# EasyEDA Pro project ProPrj_Chlorophyll two boards_2024-09-17.epro

# Schematic Spectroscope and Oxygen Sensor

## Sheets
1 Main Board: Create Date: 2024-07-14; Page Name: Main Board; Project Name: Chlorophyll two boards; Schematic Name: Spectroscope; Update Date: 2024-07-24; Company: VUB; Drawn: Tim Jäger; Page Size: A4; Part Number: Spectro-Oxy; Version: V3.2
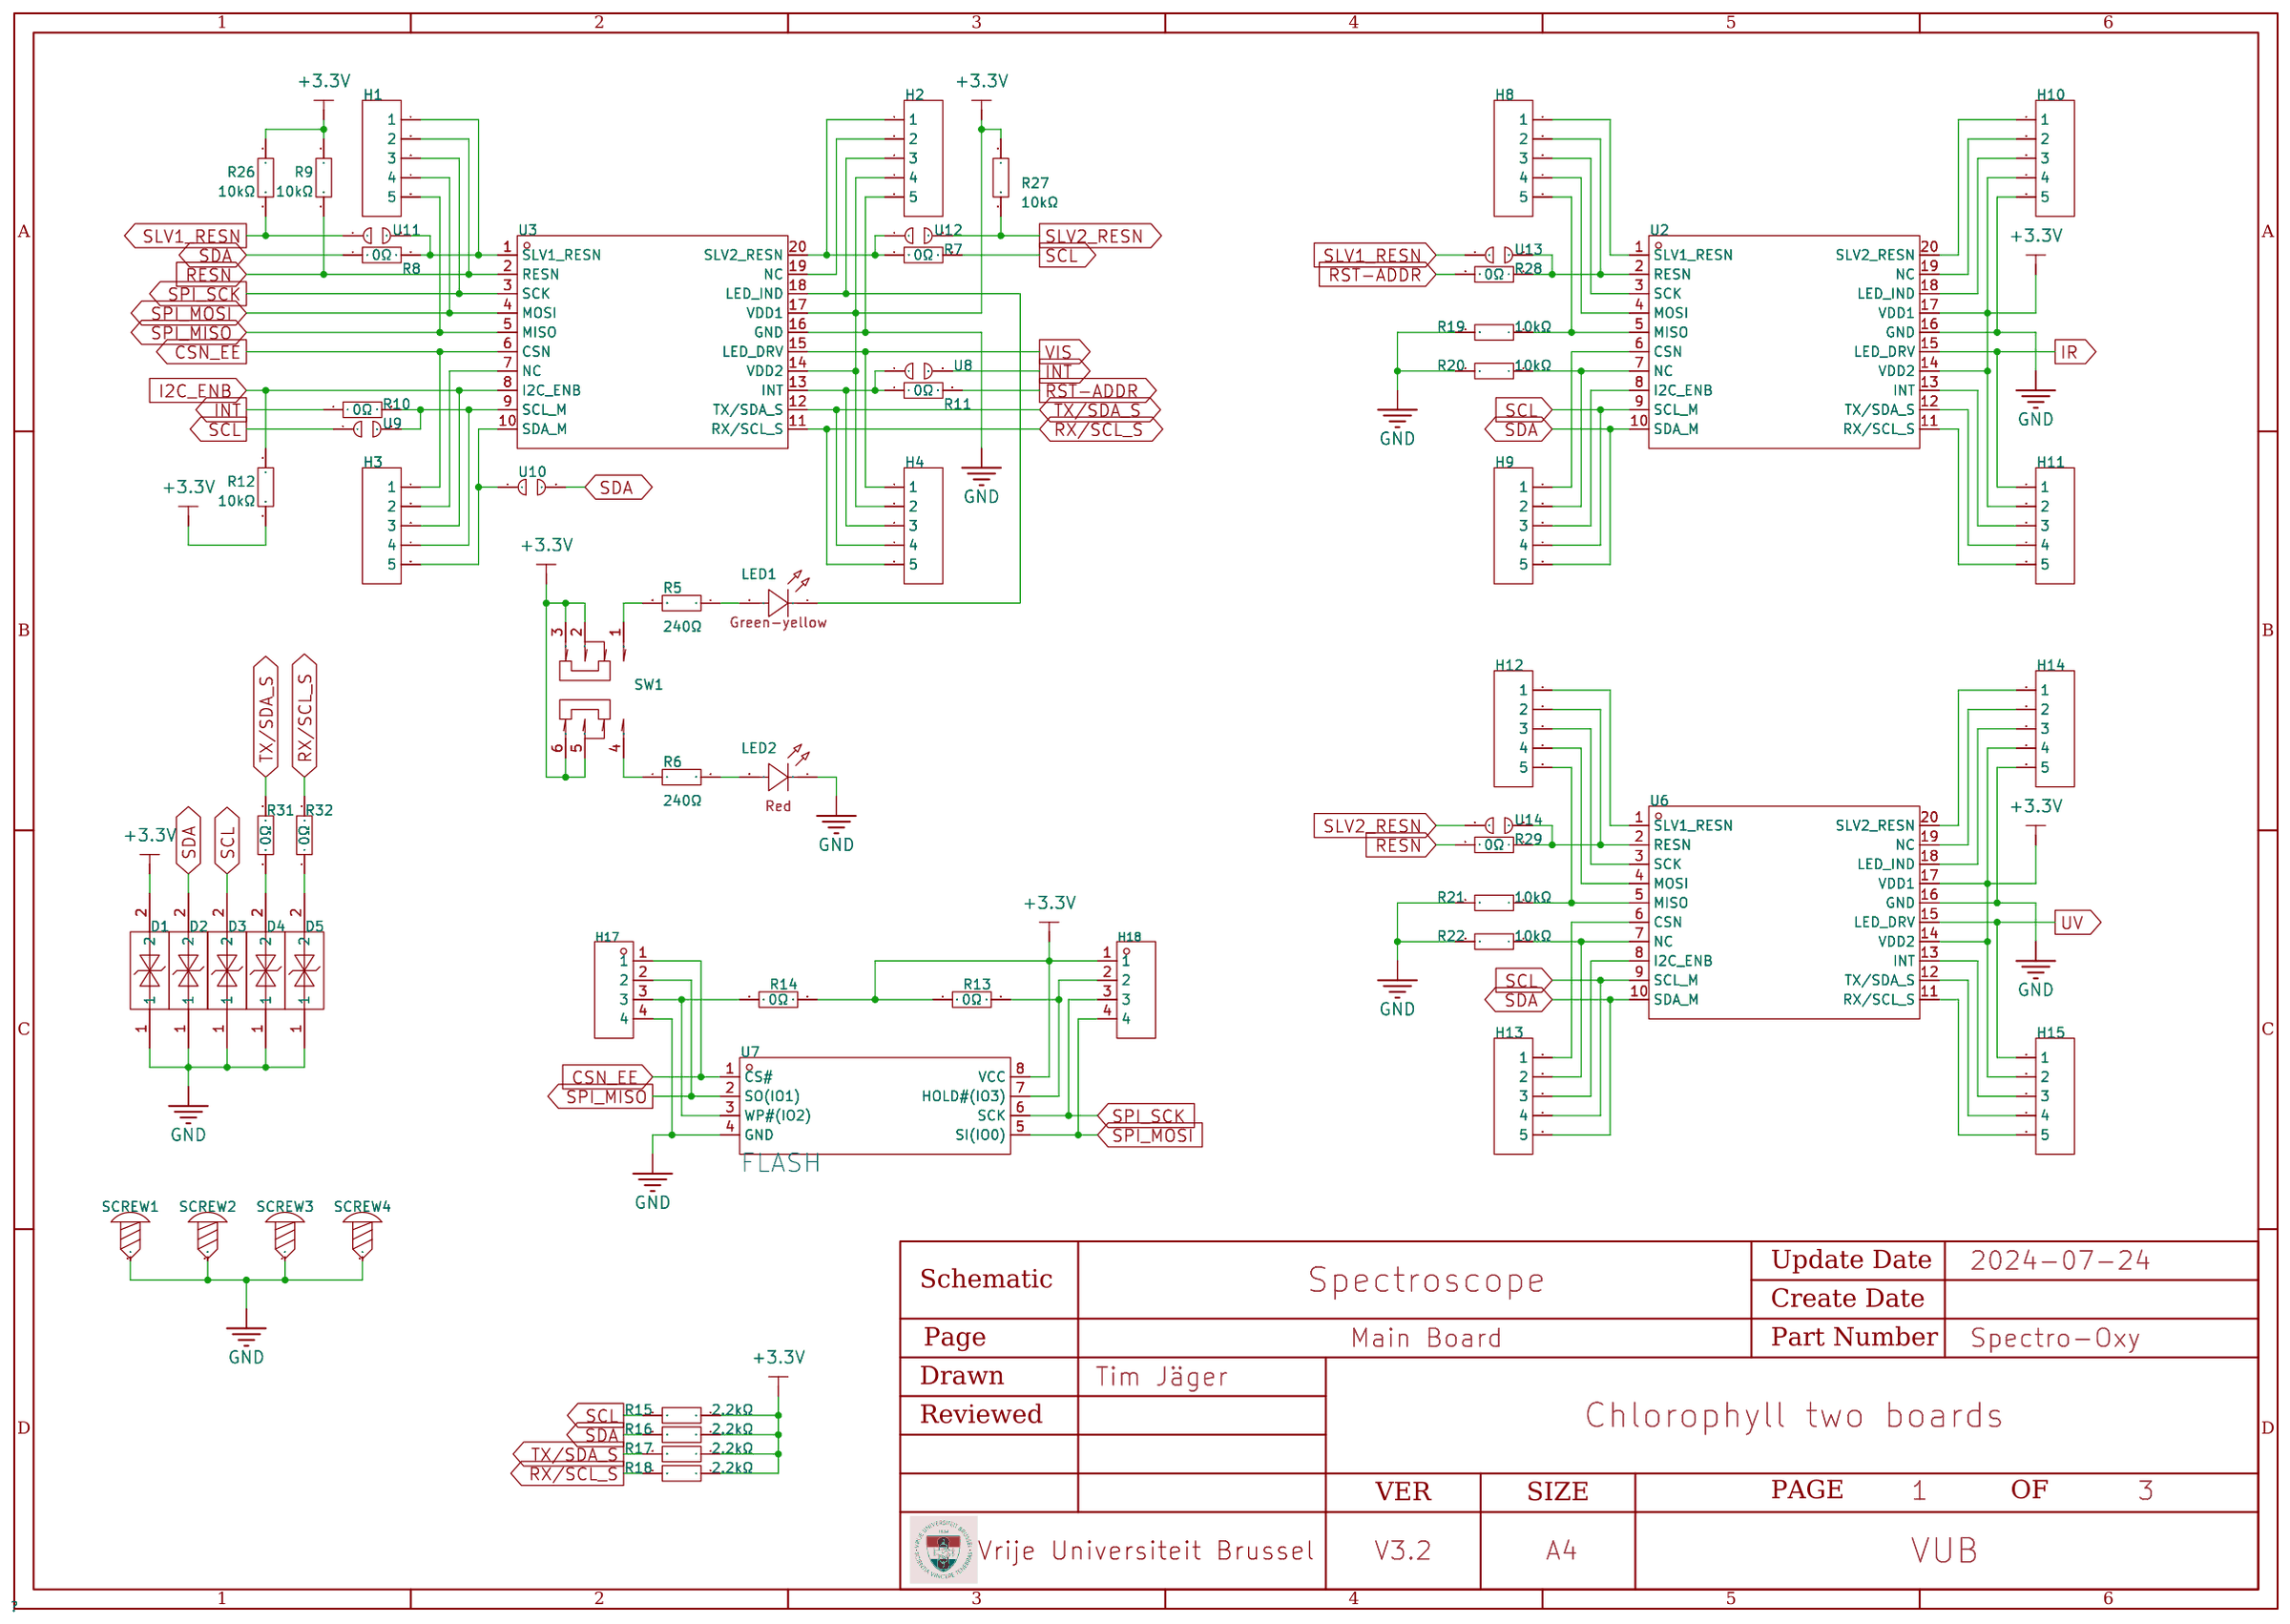
[diagram p0: Main Board]
2 Lighting Board: Page Name: Lighting Board.Schematic1; Schematic Name: Schematic1; Update Date: 2024-07-23
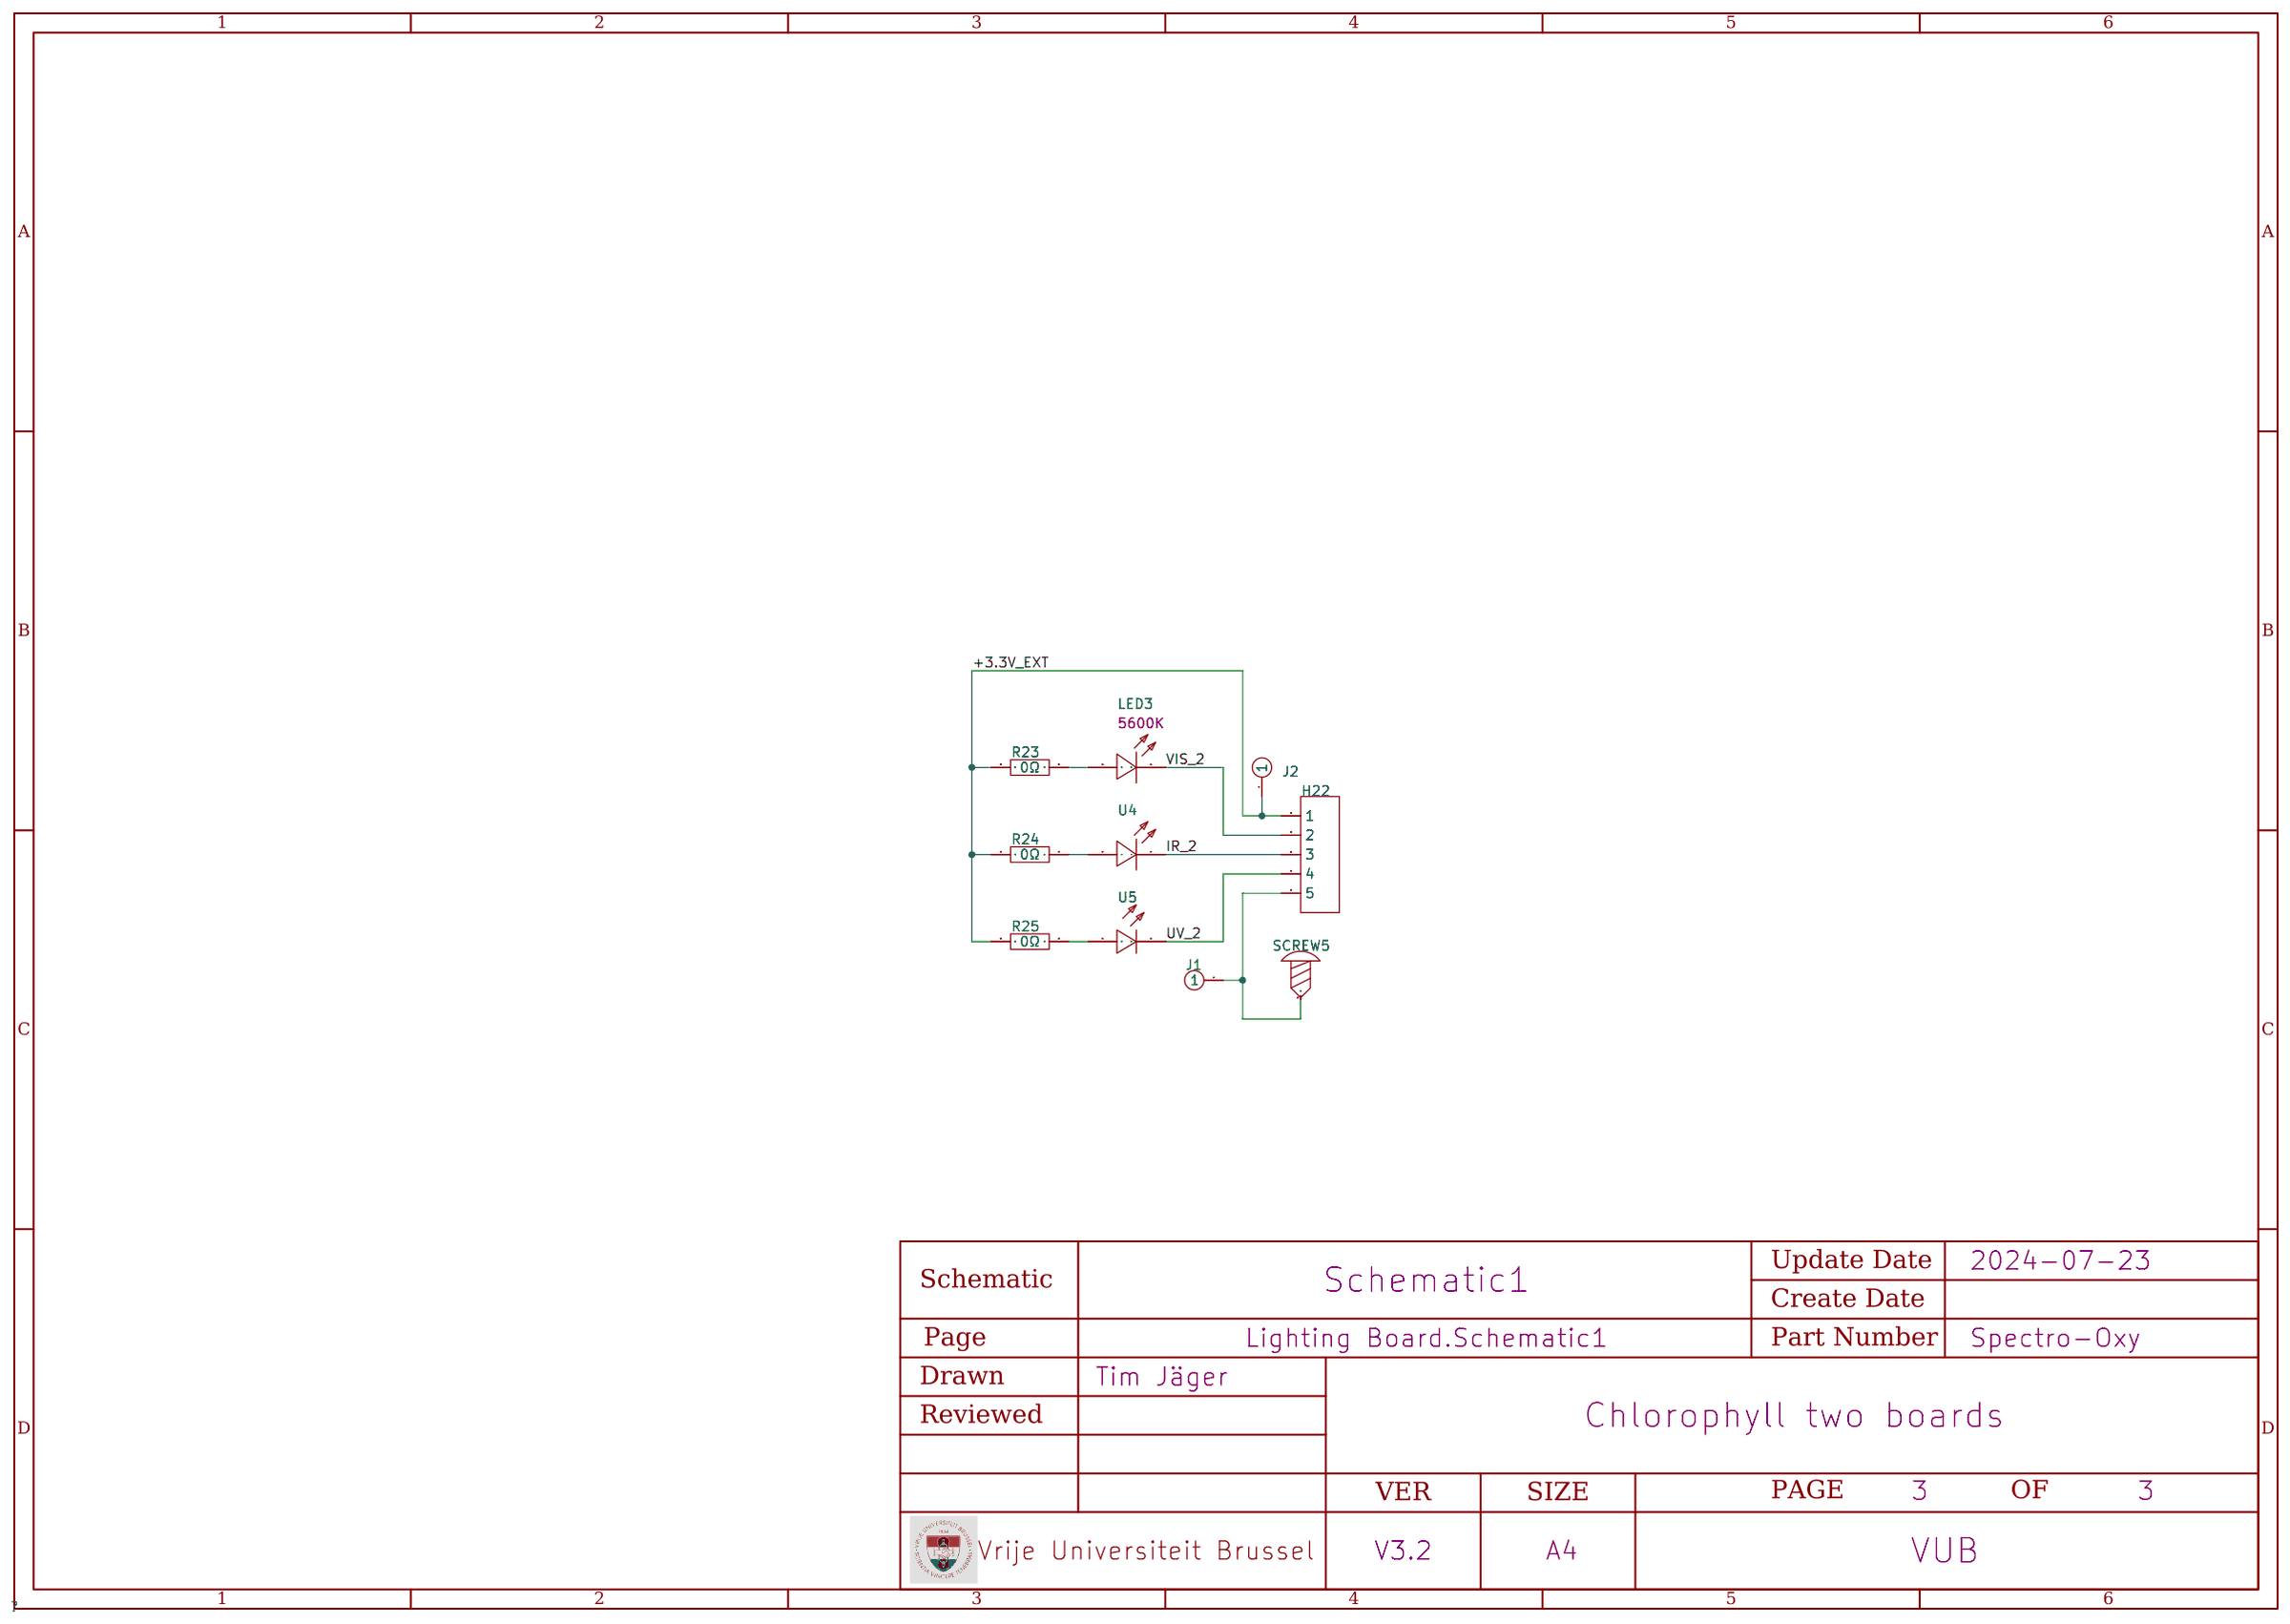
[diagram p1: Lighting Board]
3 Main Board Connectors: Create Date: 2024-07-23; Page Name: Main Board Connectors
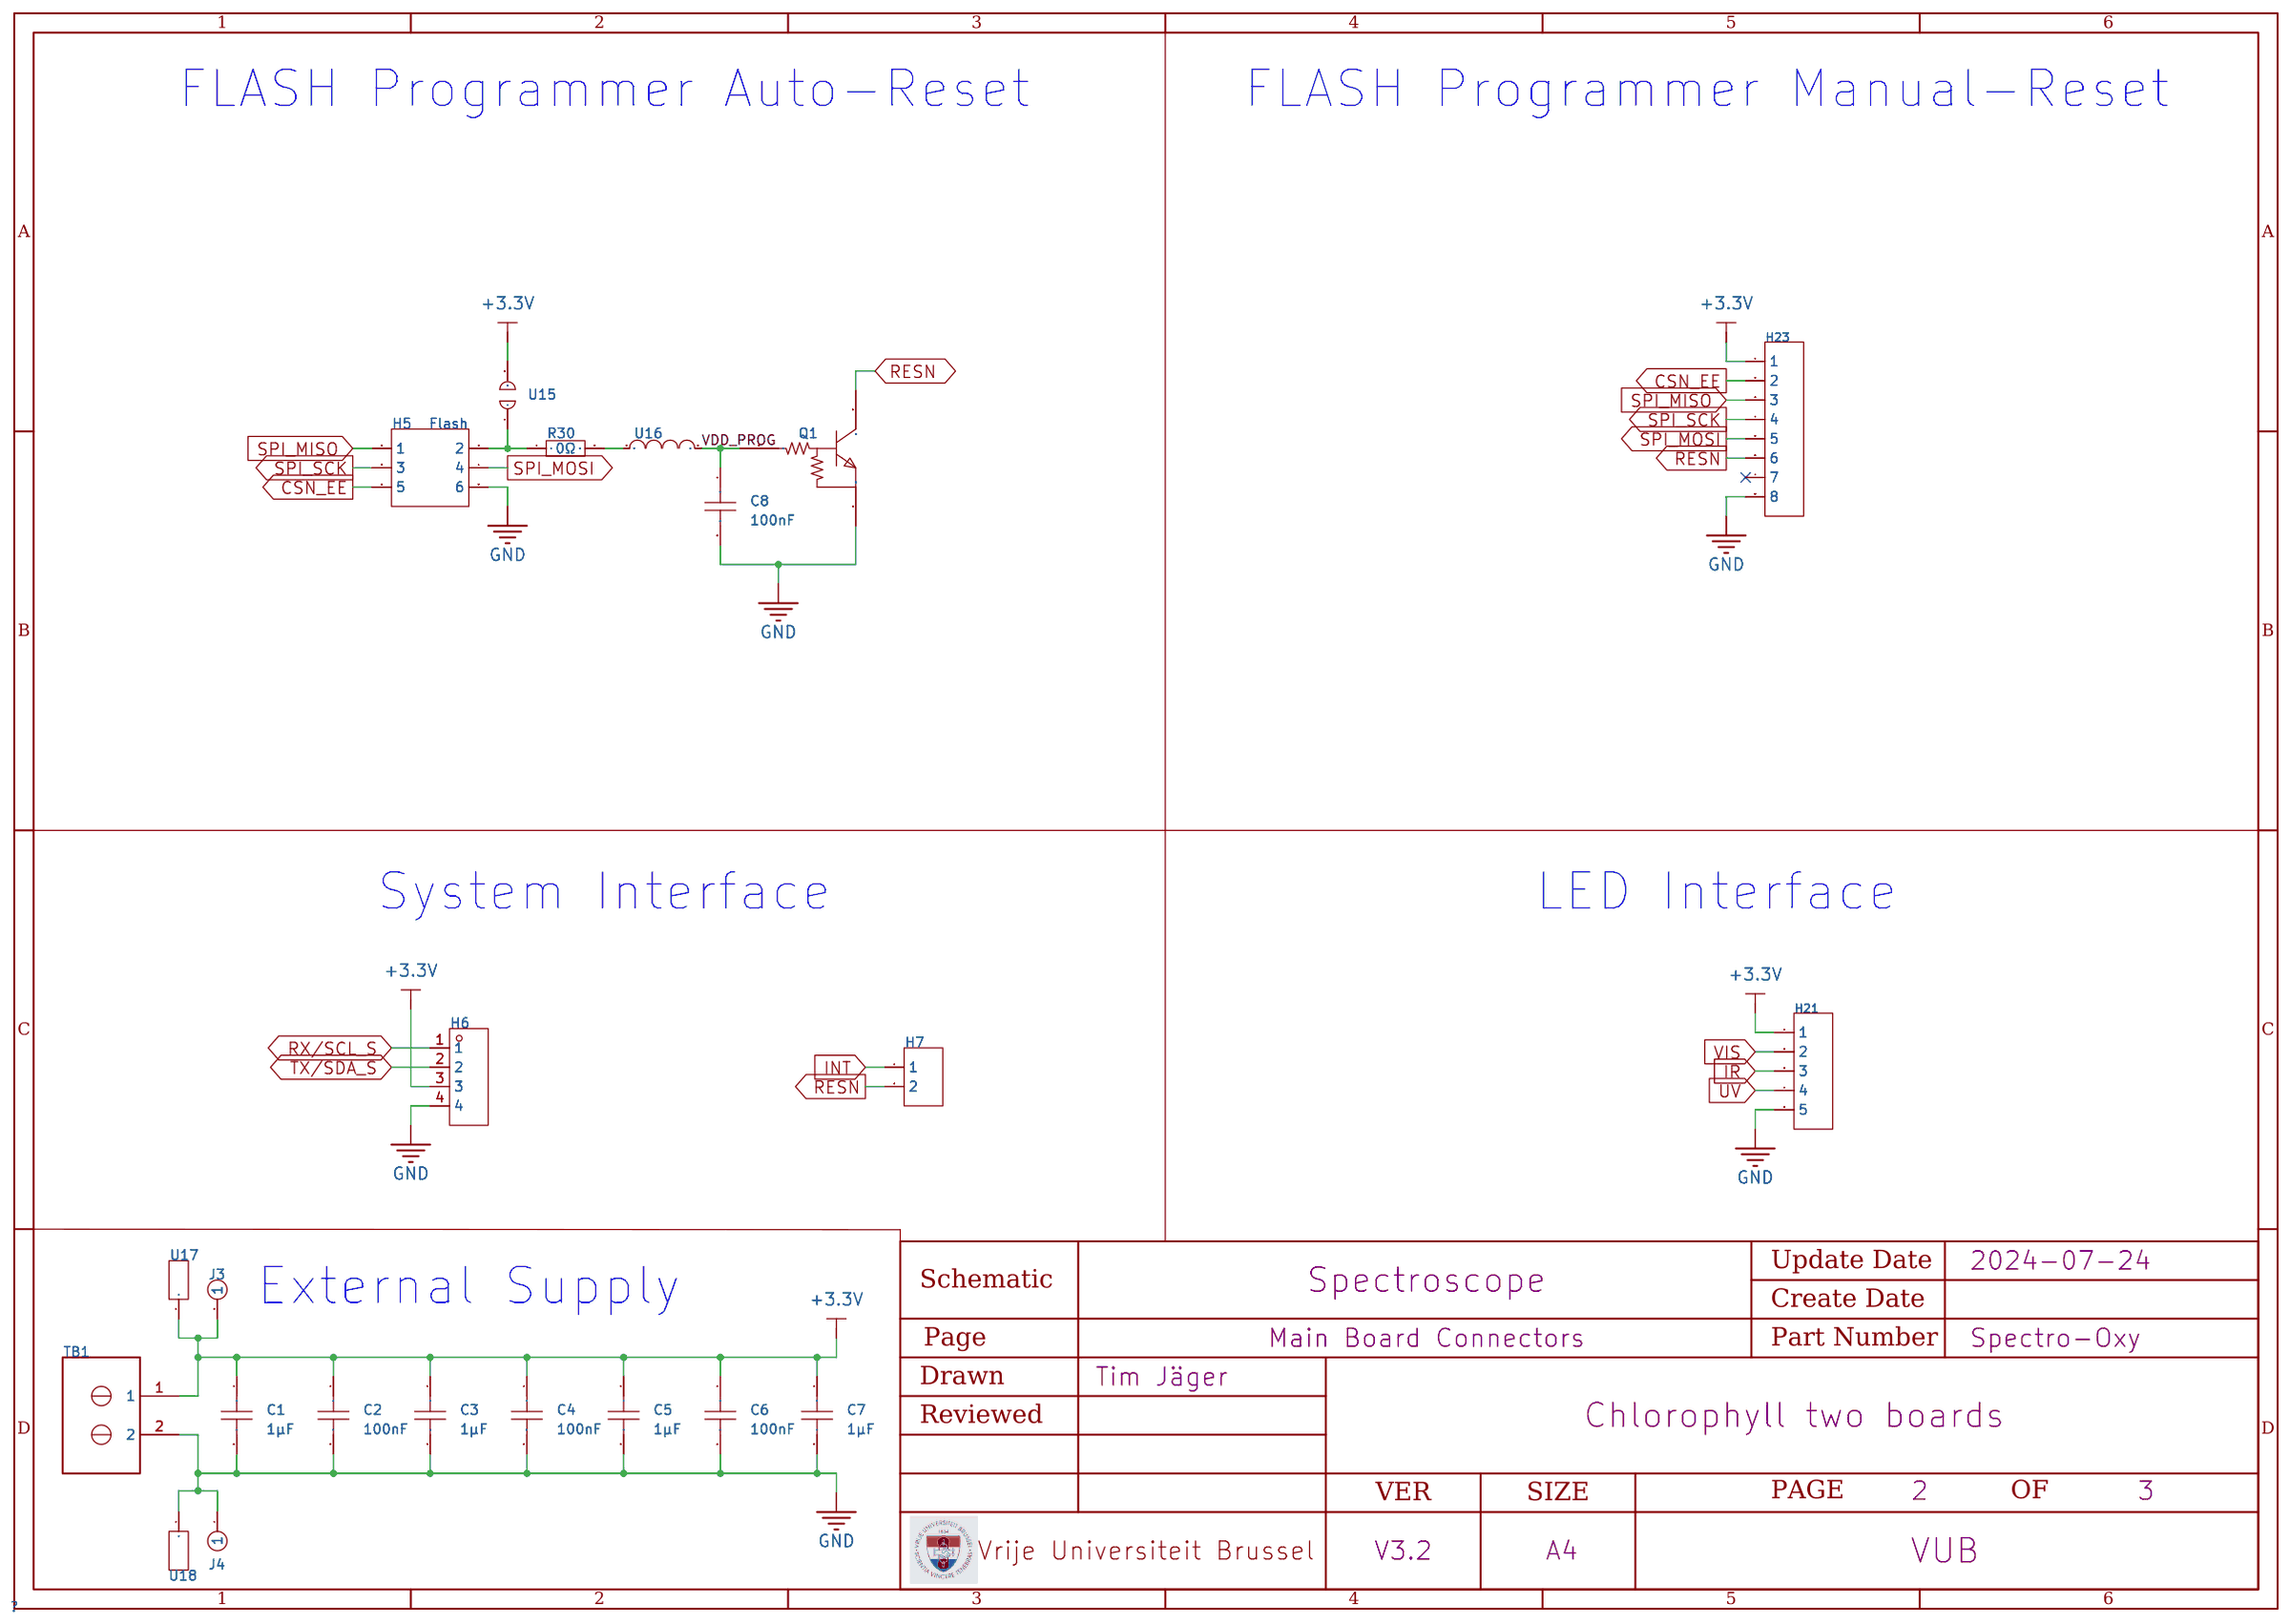
[diagram p2: Main Board Connectors]
4 Level Shifter: Create Date: 2024-07-23; Page Name: Level Shifter
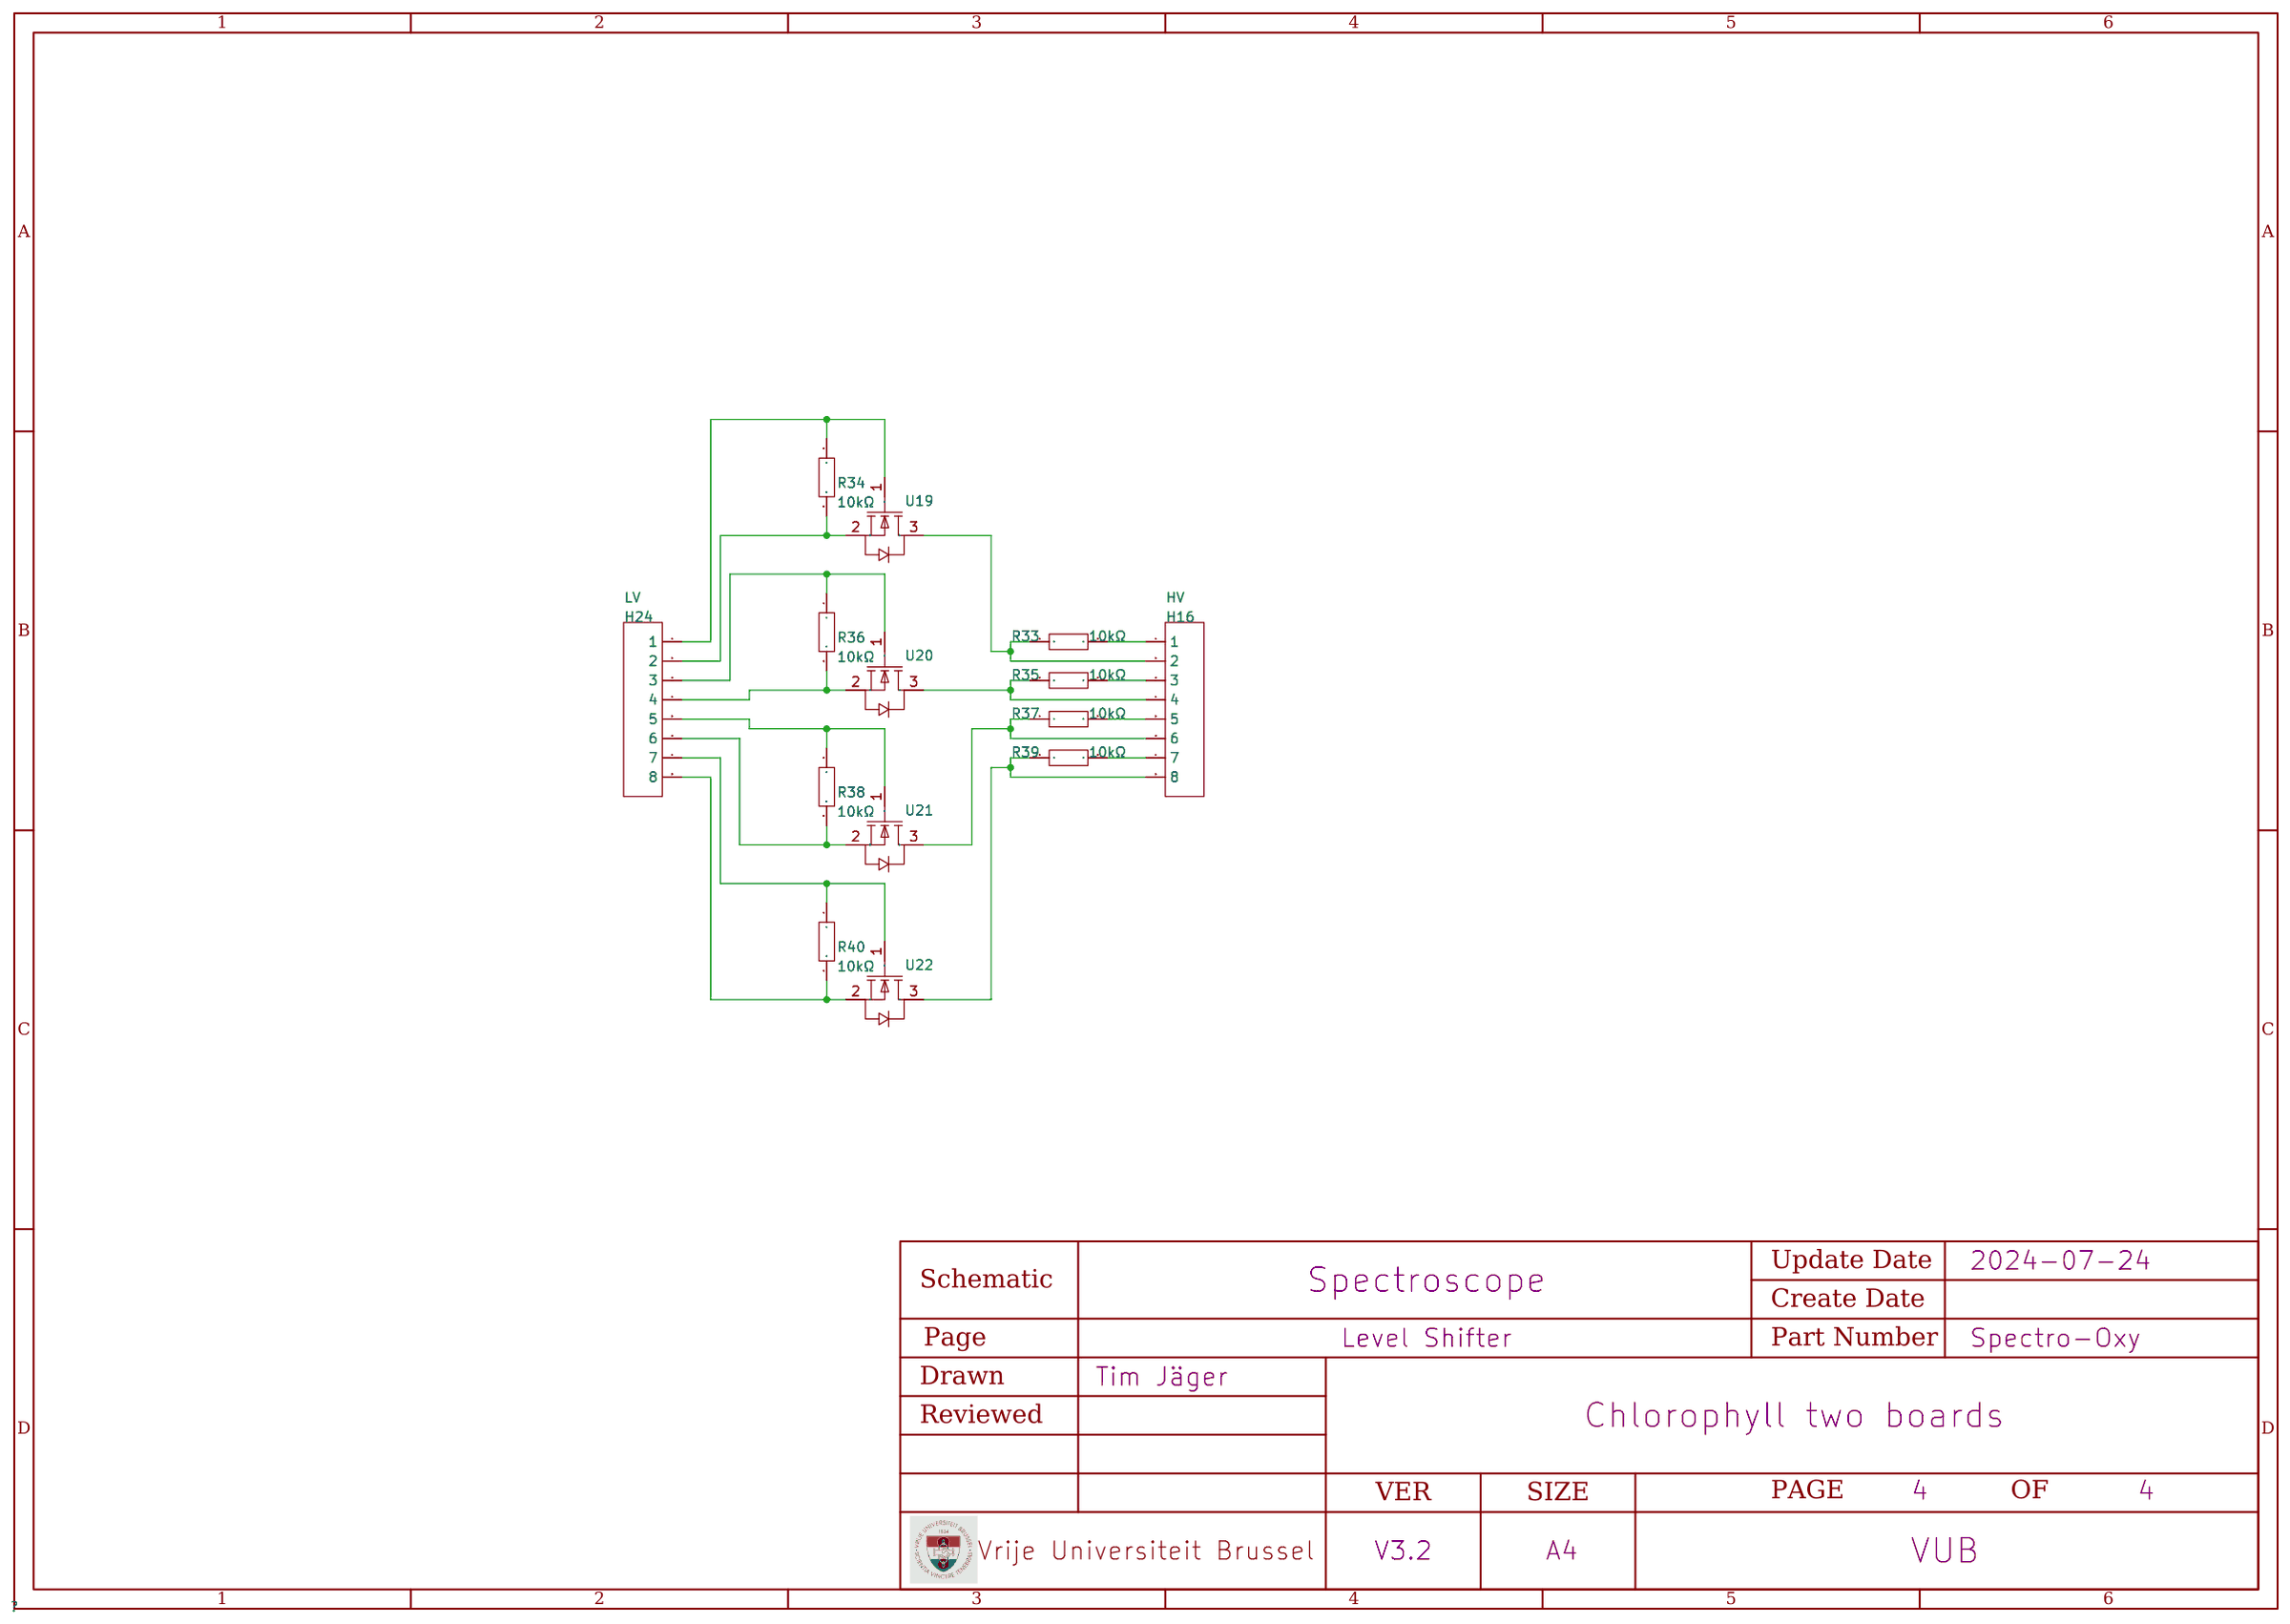
[diagram p3: Level Shifter]
5 Oxygen Sensor: Create Date: 2024-07-23; Page Name: Oxygen Sensor.Spectroscope and Oxygen Sensor; Schematic Name: Spectroscope and Oxygen Sensor
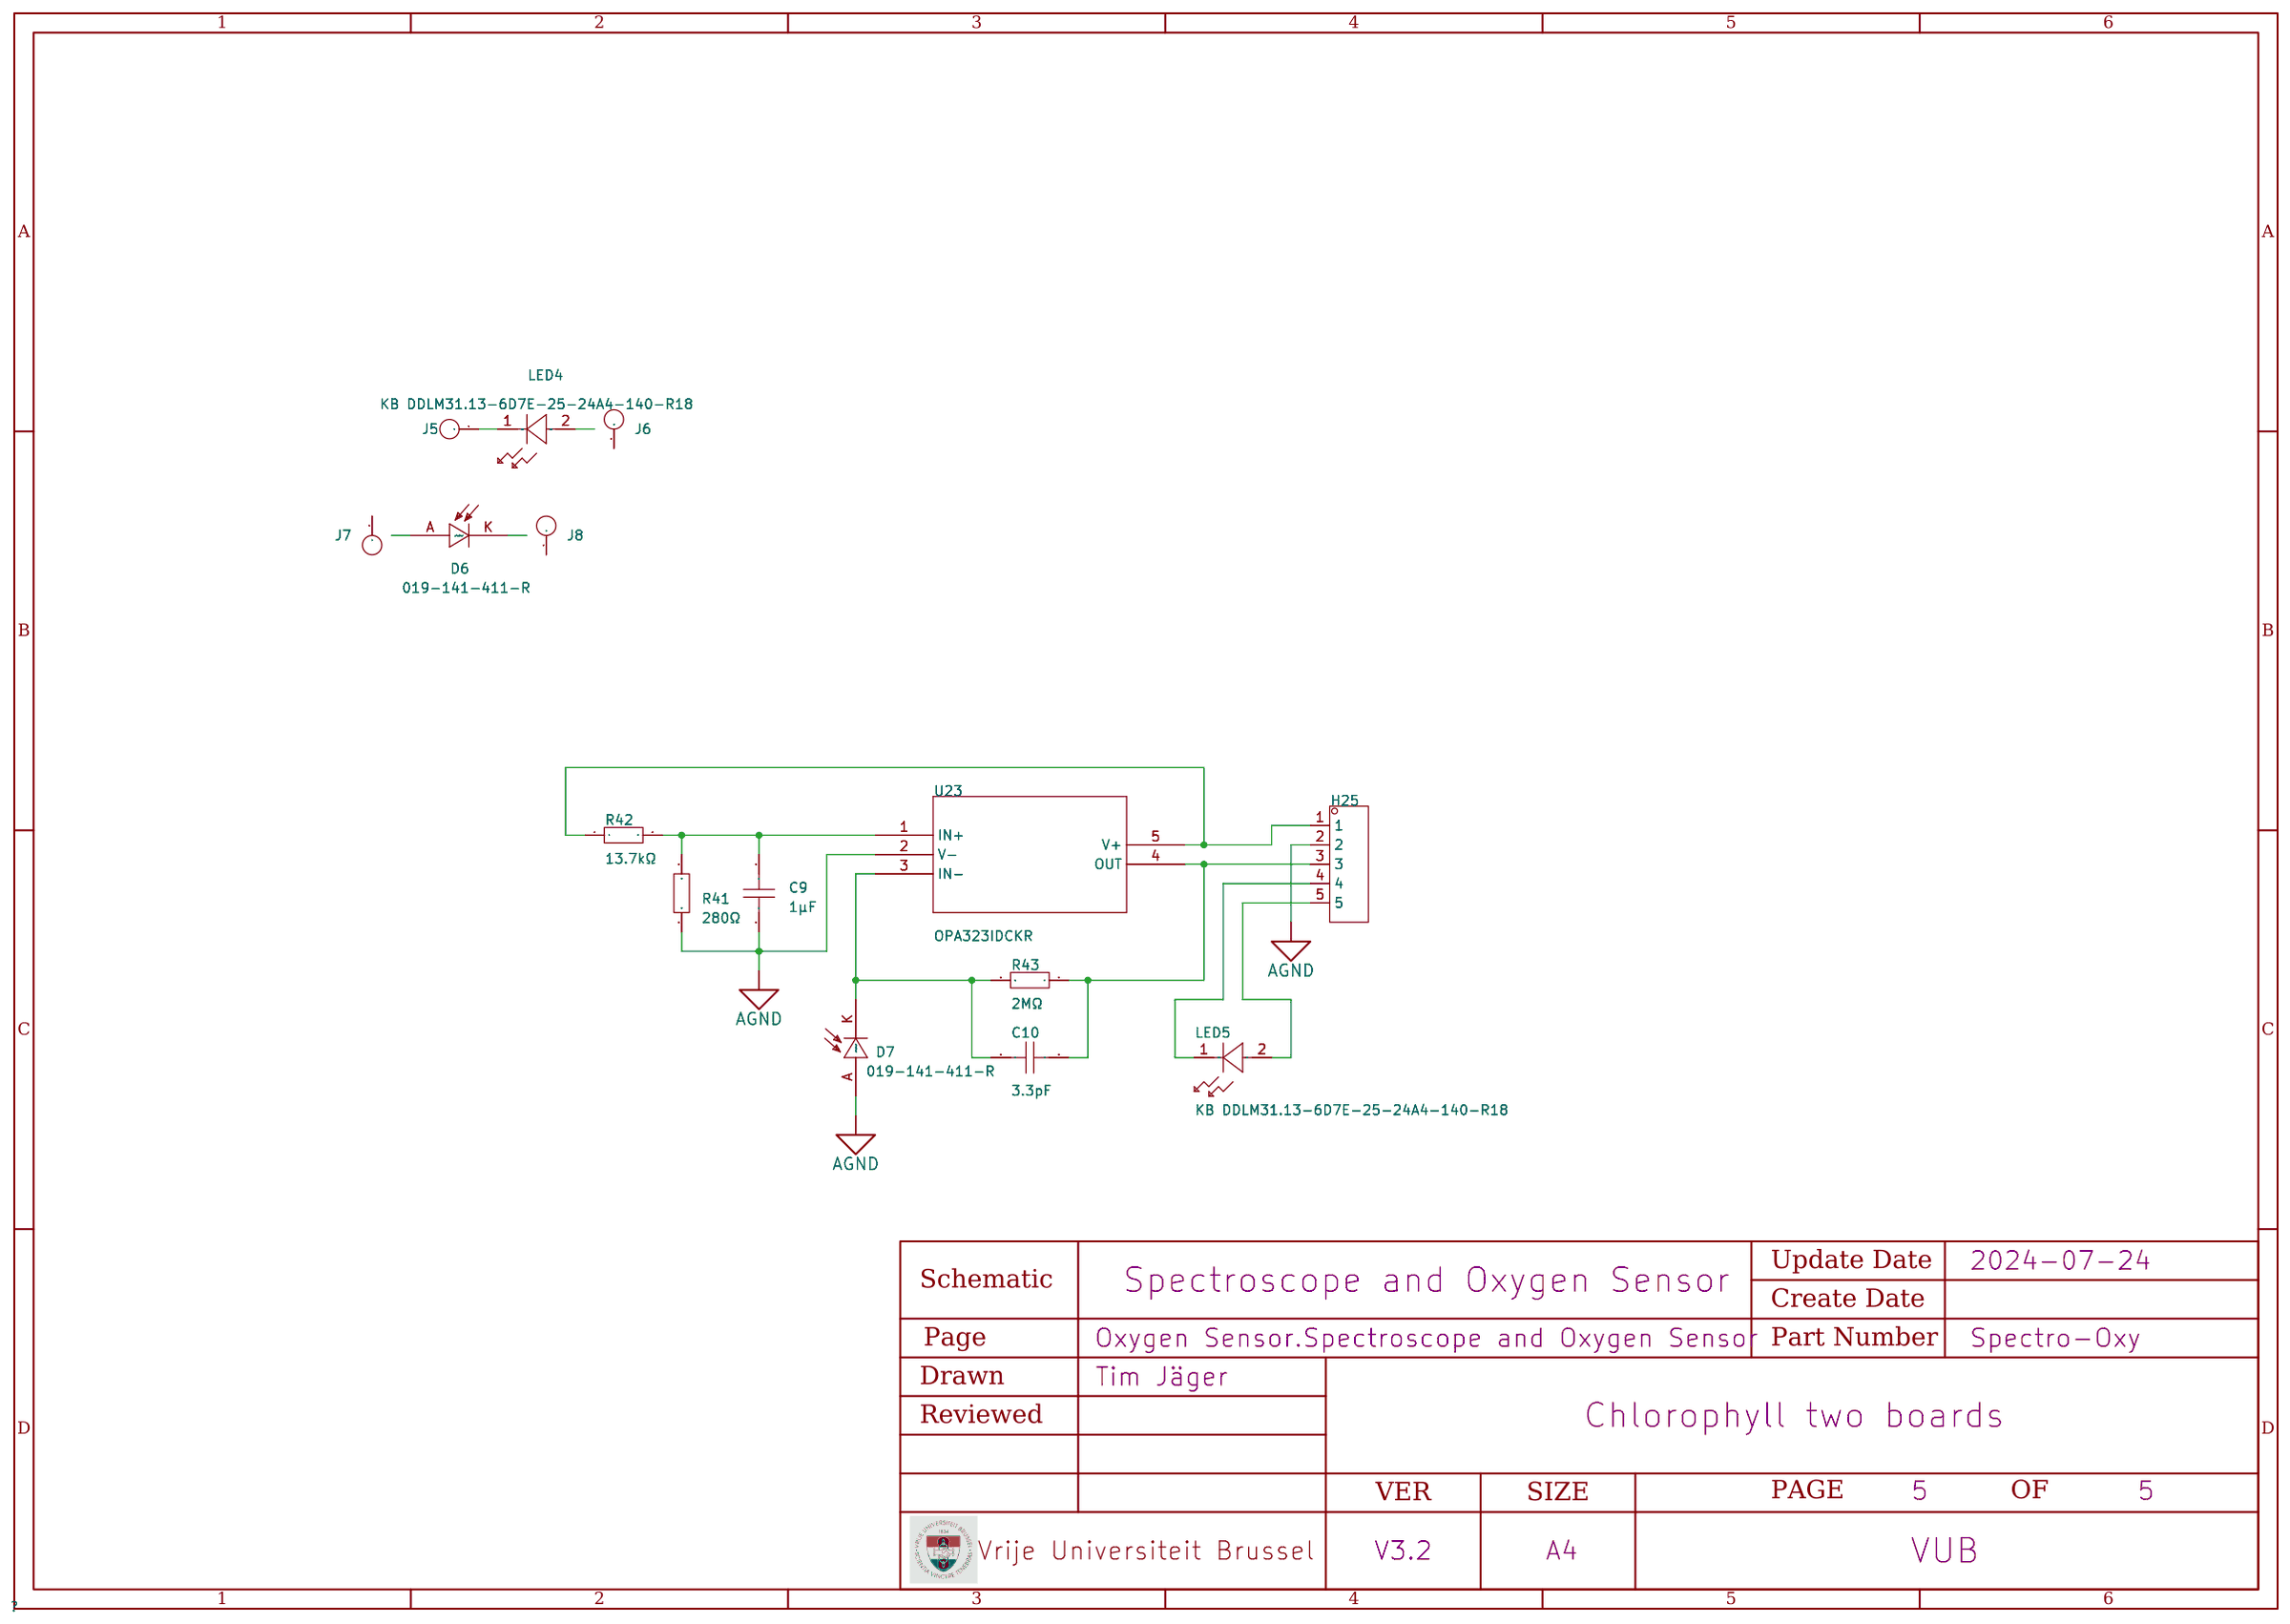
[diagram p4: Oxygen Sensor]

## Parts
sheet Level Shifter
H16  HV  [HDR-TH_8P-P2.54-V-F-1]
H24  LV  [HDR-TH_8P-P2.54-V-F-1]
R33  10kΩ  [R0805]
R34  10kΩ  [R0805]
R35  10kΩ  [R0805]
R36  10kΩ  [R0805]
R37  10kΩ  [R0805]
R38  10kΩ  [R0805]
R39  10kΩ  [R0805]
R40  10kΩ  [R0805]
U19  BSS138  [SOT-23-3_L2.9-W1.6-P1.90-LS2.8-BR]
U20  BSS138  [SOT-23-3_L2.9-W1.6-P1.90-LS2.8-BR]
U21  BSS138  [SOT-23-3_L2.9-W1.6-P1.90-LS2.8-BR]
U22  BSS138  [SOT-23-3_L2.9-W1.6-P1.90-LS2.8-BR]
sheet Lighting Board
H22  -  [HDR-TH_5P-P2.54-V-F]
J1  -  [1 Pin TH]  (no BOM)
J2  -  [1 Pin TH]  (no BOM)
LED3  HL-PC-3216H233W(6000-7000K)  [LED1206-R-RD_WHITE]
R23  0Ω  [R0805]
R24  0Ω  [R0805]
R25  0Ω  [R0805]
SCREW5  -  [Screw-Hole-M3]
U4  MHT192IR128CT  [LED0603-RD]
U5  VLMU3100-GS08  [LED-SMD_L3.2-W2.8-LS3.5-FD]
sheet Main Board Connectors
C1  1µF  [C0805]
C2  100nF  [C0805]
C3  1µF  [C0805]
C4  100nF  [C0805]
C5  1µF  [C0805]
C6  100nF  [C0805]
C7  1µF  [C0805]
C8  100nF  [C0805]
H5  Flash  [HDR-TH_6P-P2.54-V-F-R2-C3-S2.54]
H6  -  [HDR-TH_4P-P2.54-V-M]
H7  -  [HDR-TH_2P-P2.54-V-F]
H21  -  [HDR-TH_5P-P2.54-V-F]
H23  -  [HDR-TH_8P-P2.54-V-F-1]
J3  -  [1 Pin TH]  (no BOM)
J4  -  [1 Pin TH]  (no BOM)
Q1  DTC113ZUA  [SOT-323-3_L2.0-W1.3-P1.30-LS2.1-BR]
R30  0Ω  [R0805]
TB1  -  [DG126 5-2]
U15  -  [Open Solder Jumper]
U16  7427927161  [L0402]
U17  -  [Clamp Pad]
U18  -  [Clamp Pad]
sheet Main Board
D1  UCLAMP3311T.TCT  [SLP1006P2T_L1.0-W0.6-P0.65-L]
D2  UCLAMP3311T.TCT  [SLP1006P2T_L1.0-W0.6-P0.65-L]
D3  UCLAMP3311T.TCT  [SLP1006P2T_L1.0-W0.6-P0.65-L]
D4  UCLAMP3311T.TCT  [SLP1006P2T_L1.0-W0.6-P0.65-L]
D5  UCLAMP3311T.TCT  [SLP1006P2T_L1.0-W0.6-P0.65-L]
H1  -  [HDR-TH_5P-P2.54-V-F]
H2  -  [HDR-TH_5P-P2.54-V-F]
H3  -  [HDR-TH_5P-P2.54-V-F]
H4  -  [HDR-TH_5P-P2.54-V-F]
H8  -  [HDR-TH_5P-P2.54-V-F]
H9  -  [HDR-TH_5P-P2.54-V-F]
H10  -  [HDR-TH_5P-P2.54-V-F]
H11  -  [HDR-TH_5P-P2.54-V-F]
H12  -  [HDR-TH_5P-P2.54-V-F]
H13  -  [HDR-TH_5P-P2.54-V-F]
H14  -  [HDR-TH_5P-P2.54-V-F]
H15  -  [HDR-TH_5P-P2.54-V-F]
H17  -  [HDR-TH_4P-P2.54-V-F]
H18  -  [HDR-TH_4P-P2.54-V-F]
LED1  XL-2012SYGC  [LED0805-RD_GREEN]
LED2  XL-2012SURC  [LED0805-RD_RED]
R5  240Ω  [R0805]
R6  240Ω  [R0805]
R7  0Ω  [R0805]
R8  0Ω  [R0805]
R9  10kΩ  [R0805]
R10  0Ω  [R0805]
R11  0Ω  [R0805]
R12  10kΩ  [R0805]
R13  0Ω  [R0805]
R14  0Ω  [R0805]
R15  2.2kΩ  [R0805]
R16  2.2kΩ  [R0805]
R17  2.2kΩ  [R0805]
R18  2.2kΩ  [R0805]
R19  10kΩ  [R0805]
R20  10kΩ  [R0805]
R21  10kΩ  [R0805]
R22  10kΩ  [R0805]
R26  10kΩ  [R0805]
R27  10kΩ  [R0805]
R28  0Ω  [R0805]
R29  0Ω  [R0805]
R31  0Ω  [R0805]
R32  0Ω  [R0805]
SCREW1  -  [Screw-Hole-M3]
SCREW2  -  [Screw-Hole-M3]
SCREW3  -  [Screw-Hole-M3]
SCREW4  -  [Screw-Hole-M3]
SW1  SK-3245S-L3-B  [SW-SMD_SK-3245S-L3-B]
U2  AS72652-BLGT  [LGA-20_L4.7-W4.5-P0.65-TL-1]
U3  AS72651-BLGT  [LGA-20_L4.7-W4.5-P0.65-TL-1]
U6  AS72653-BLGT  [LGA-20_L4.7-W4.5-P0.65-TL-1]
U7  AT25SF041B-SSHB-T  [SOIC-8_L4.9-W3.9-P1.27-LS6.0-BL]
U8  -  [Open Solder Jumper]
U9  -  [Open Solder Jumper]
U10  -  [Open Solder Jumper]
U11  -  [Open Solder Jumper]
U12  -  [Open Solder Jumper]
U13  -  [Open Solder Jumper]
U14  -  [Open Solder Jumper]
sheet Oxygen Sensor
C9  1µF  [C0805]
C10  3.3pF  [C0805]
D6  019-141-411-R  [DIOC2012X80N]
D7  019-141-411-R  [DIOC2012X80N]
H25  -  [HDR-TH_5P-P2.54-V-M]
J5  -  [Small Pin TH]
J6  -  [Small Pin TH]
J7  -  [Small Pin TH]
J8  -  [Small Pin TH]
LED4  KB DDLM31.13-6D7E-25-24A4-140-R18  [LED_KB_DDLM31.13-6D7E-25-24A4-140-R18_OSR]
LED5  KB DDLM31.13-6D7E-25-24A4-140-R18  [LED_KB_DDLM31.13-6D7E-25-24A4-140-R18_OSR]
R41  280Ω  [R0805]
R42  13.7kΩ  [R0805]
R43  2MΩ  [R0805]
U23  OPA323IDCKR  [SC70-5_DCK_TEX]

## Library data of the parts
H16 H23 H24 = HDR-F_2.54_1x8P: Supplier Footprint: Through
R9 R12 R19-R22 R26 R27 R33-R40 = RC0805FR-0710KL: Type:Thick Film Resistors Resistance: Tolerance:±1% Tolerance:±1% Power(Watts): Overload Voltage (Max): Temperature Coefficient:±100ppm/℃ Temperature Coefficient:±100ppm/℃ Operating Temperature Range:-55℃~+155℃ Operating Temperature Range:-55℃~+155℃; LCSC Part Name: 厚膜电阻 10kΩ ±1% 125mW; Supplier Part: C84376; Manufacturer: YAGEO(国巨); Supplier Footprint: 0805; JLCPCB Part Class: Extended Part; Datasheet: https://atta.szlcsc.com/upload/public/pdf/source/20170708/1499509500945.pdf; Supplier: LCSC; Type: Thick Film Resistors; Tolerance: ±1%; Temperature Coefficient: ±100ppm/℃; Operating Temperature Range: -55℃~+155℃
U19-U22 = BSS138_C18212695: Supplier Part: C18212695; Manufacturer: TECH PUBLIC(台舟); Supplier Footprint: SOT-23; Datasheet: https://atta.szlcsc.com/upload/public/pdf/source/20231024/96ACE9C5A32B7F4113654DA9CE24FCA4.pdf; Supplier: LCSC
H1-H4 H8-H15 H21 H22 = HDR-F_2.54_1x5P: Supplier Footprint: Through
J1-J4 = 1 pin th
LED3 = HL-PC-3216H233W(6000-7000K): Emitted Color:White Forward Voltage (VF):3.4V Forward Voltage (VF):3.4V Power Dissipation:102mW Forward Current:20mA Dominant Wavelength:- Dominant Wavelength:- Peak Wavelength:- Diode Configuration:- Lens Color:雾状黄透镜 Color Temperature:6000K~7000K Color T; Supplier Part: C219234; Manufacturer: HONGLITRONIC(鸿利光电); Supplier Footprint: 1206; JLCPCB Part Class: Extended Part; Datasheet: https://atta.szlcsc.com/upload/public/pdf/source/20200909/C219234_9DC88F736CAB0E320AF31452CF73B963.pdf; Supplier: LCSC; Emitted Color: White; Forward Voltage (VF): 3.4V; Power Dissipation: 102mW; Forward Current: 20mA; Lens Color: 雾状黄透镜; Color Temperature: 5600K; Luminous Intensity: 1300mcd; Viewing Angle: 140°; Mounting Sytle: Positive post; Operating Temperature: -40℃~+85℃
R5-R8 R10 R11 R13-R18 R23-R25 R28-R32 R41-R43 = 0805W8F2400T5E: Type:Thick Film Resistors Resistance: Tolerance:±1% Tolerance:±1% Power(Watts): Overload Voltage (Max): Temperature Coefficient:±100ppm/℃ Temperature Coefficient:±100ppm/℃ Operating Temperature Range:-55℃~+155℃ Operating Temperature Range:-55℃~+155℃; LCSC Part Name: 240Ω ±1% 125mW 厚膜电阻; Supplier Part: C17572; Manufacturer: UNI-ROYAL(厚声); Supplier Footprint: 0805; JLCPCB Part Class: Extended Part; Datasheet: https://atta.szlcsc.com/upload/public/pdf/source/20200306/C422600_1E6D84923E4A46A82E41ADD87F860B5C.pdf; Supplier: LCSC; Type: Thick Film Resistors; Tolerance: ±1%; Temperature Coefficient: ±100ppm/℃; Operating Temperature Range: -55℃~+155℃
SCREW1-SCREW5 = Screw-Hole-M3: Supplier Footprint: 插件
U4 = MHT192IR128CT: Vf - Forward Voltage:2.2V；1.2V~1.7V Vf - Forward Voltage:2.2V；1.2V~1.7V Wavelength:850nm Wavelength:850nm Radiant Intensity:1.0mW/sr~4.0mW/sr；13mW/sr Current - DC Forward (If):20mA Reverse Voltage:5V View Angle:120° Operating Temperature:-40℃~+85℃ Operati; LCSC Part Name: 0603正贴红外发射透明IR850nm120°0.6T; Supplier Part: C412284; Manufacturer: MEIHUA(美华); Supplier Footprint: 0603; JLCPCB Part Class: Extended Part; Datasheet: https://atta.szlcsc.com/upload/public/pdf/source/20210412/C412284_937E51CFF8BF8524B98ADFDE233BB1EC.pdf; Supplier: LCSC; Vf - Forward Voltage: 2.2V；1.2V~1.7V; Wavelength: 850nm; Radiant Intensity: 1.0mW/sr~4.0mW/sr；13mW/sr; Current - DC Forward (If): 20mA; Reverse Voltage: 5V; View Angle: 120°; Operating Temperature: -40℃~+85℃
U5 = VLMU3100-GS08: Peak Wavelength:405nm Forward Voltage:3.2V Forward Current:30mA Viewing Angle:120° Operating Temperature:-40℃~+80℃ Operating Temperature:-40℃~+80℃ Radiant Flux:2.5mW; LCSC Part Name: LED; Supplier Part: C5280615; Manufacturer: VISHAY(威世); Supplier Footprint: SMD,2.8x3.2mm; JLCPCB Part Class: Extended Part; Datasheet: https://atta.szlcsc.com/upload/public/pdf/source/20221123/D7A4BA0FE704702AA4DAFA18A216FE95.pdf; Supplier: LCSC; Peak Wavelength: 405nm; Forward Voltage: 3.2V; Forward Current: 30mA; Viewing Angle: 120°; Operating Temperature: -40℃~+80℃; Radiant Flux: 2.5mW
C1-C10 = CAP_0805: Supplier Footprint: 0805
H5 = HDR-F-2.54_2x3: Supplier Footprint: Through
H6 = HDR-M_2.54_1x4P: Supplier Footprint: Through
H7 = HDR-F_2.54_1x2P: Supplier Footprint: Through
Q1 = DTC113ZUA: Supplier Part: C2910235; Manufacturer: CJ(江苏长电/长晶); Supplier Footprint: SOT-323-3; JLCPCB Part Class: Extended Part; Datasheet: https://atta.szlcsc.com/upload/public/pdf/source/20211124/6AF0ED3B650A4113345295244F66B3E0.pdf; Supplier: LCSC
TB1 = DG126 5-2
U8-U15 = Open Solder Jumper
U16 = 7427927161: Impedance @ Frequency:600Ω@100MHz Tolerance:±25% Tolerance:±25% DC Resistance:560mΩ Current Rating:510mA Circuits:1; LCSC Part Name: 单路 0402磁珠 阻抗600Ω@100MHz; Supplier Part: C2661488; Manufacturer: Wurth(伍尔特); Supplier Footprint: 0402; JLCPCB Part Class: Extended Part; Supplier: LCSC; Impedance @ Frequency: 600Ω@100MHz; Tolerance: ±25%; DC Resistance: 560mΩ; Current Rating: 510mA; Circuits: 1
U17 U18 = Clamp Pad
D1-D5 = UCLAMP3311T.TCT: polarity:Bi-Directional Reverse Stand-Off Voltage (Vrwm):3.3V Maximum Clamping Voltage:8V Peak Pulse Current (Ipp)@10/1000us:5A Peak Pulse Power Dissipation (Ppp)@10/1000us:40W Breakdown Voltage:3.5V Operating Temperature:-40℃~+85℃@(Tj) Operating Temperat; LCSC Part Name: 双向ESD; Supplier Part: C117567; Manufacturer: SEMTECH; Supplier Footprint: SLP1006-2; JLCPCB Part Class: Extended Part; Datasheet: https://atta.szlcsc.com/upload/public/pdf/source/20170704/1499151366480.pdf; Supplier: LCSC; polarity: Bi-Directional; Reverse Stand-Off Voltage (Vrwm): 3.3V; Maximum Clamping Voltage: 8V; Peak Pulse Current (Ipp)@10/1000us: 5A; Peak Pulse Power Dissipation (Ppp)@10/1000us: 40W; Breakdown Voltage: 3.5V; Operating Temperature: -40℃~+85℃@(Tj); Type: ESD
H17 H18 = HDR-F_2.54_1x4P: Supplier Footprint: Through
LED1 = XL-2012SYGC: Emitted Color:Green-yellow Power Dissipation:55mW Forward Current:25mA Dominant Wavelength:571nm~573nm Dominant Wavelength:571nm~573nm Peak Wavelength:575nm Lens Color:无色透明透镜 Color Temperature:- Color Temperature:- Viewing Angle:120° Mounting Sytle:Positi; Supplier Part: C965816; Manufacturer: XINGLIGHT(成兴光); Supplier Footprint: 0805; JLCPCB Part Class: Extended Part; Datasheet: https://atta.szlcsc.com/upload/public/pdf/source/20240218/33A7A1C9B7559875425299FF3D6B2704.pdf; Supplier: LCSC; Emitted Color: Green-yellow; Power Dissipation: 55mW; Forward Current: 25mA; Dominant Wavelength: 571nm~573nm; Peak Wavelength: 575nm; Lens Color: 无色透明透镜; Viewing Angle: 120°; Mounting Sytle: Positive post; Operating Temperature: -30℃~+85℃
LED2 = XL-2012SURC: Emitted Color:Red Power Dissipation:55mW Forward Current:25mA Dominant Wavelength:617nm~621nm Dominant Wavelength:617nm~621nm Peak Wavelength:623nm Lens Color:无色透明透镜 Color Temperature:- Color Temperature:- Viewing Angle:120° Mounting Sytle:Positive post O; Supplier Part: C965812; Manufacturer: XINGLIGHT(成兴光); Supplier Footprint: 0805; JLCPCB Part Class: Extended Part; Datasheet: https://atta.szlcsc.com/upload/public/pdf/source/20221102/49E1A0A365644091E6270AF1C5E0FE37.pdf; Supplier: LCSC; Emitted Color: Red; Power Dissipation: 55mW; Forward Current: 25mA; Dominant Wavelength: 617nm~621nm; Peak Wavelength: 623nm; Lens Color: 无色透明透镜; Viewing Angle: 120°; Mounting Sytle: Positive post; Operating Temperature: -30℃~+85℃
SW1 = SK-3245S-L3-B: Circuit:DPDT Actuator Style:Rectangular columnar Pin Style:SMDSplicing Switch Length:9.1mm Switch Width:3.55mm Switch Height:3.2mm Mounting Style:卧贴 Actuator Color:Black Current Rating (DC):50mA Voltage Rating (DC):12V Current Rating (AC):50mA Voltage Rat; LCSC Part Name: 柄长3mm 卧贴双档 滑动开关; Supplier Part: C405954; Manufacturer: XKB Connectivity(中国星坤); Supplier Footprint: SMD; JLCPCB Part Class: Extended Part; Datasheet: https://atta.szlcsc.com/upload/public/pdf/source/20211011/150604CD043E0D261356905071EFEC5D.pdf; Supplier: LCSC; Circuit: DPDT; Actuator Style: Rectangular columnar; Pin Style: SMDSplicing; Switch Length: 9.1mm; Switch Width: 3.55mm; Switch Height: 3.2mm; Mounting Style: 卧贴; Actuator Color: Black; Current Rating (DC): 50mA; Voltage Rating (DC): 12V; Current Rating (AC): 50mA; Voltage Rating (AC): 12V; Mechanical Life: 1万次; Operating Temperature: -40℃~+85℃
U2 = AS72652-BLGT: Supply Voltage:2.7V~3.6V Supply Voltage:2.7V~3.6V Resolution:16 Operating Temperature:-40℃~+85℃ Operating Temperature:-40℃~+85℃; LCSC Part Name: AS72652 BLGT; Supplier Part: C2654923; Manufacturer: AMS; Supplier Footprint: LGA-20; JLCPCB Part Class: Extended Part; Datasheet: https://atta.szlcsc.com/upload/public/pdf/source/20210417/CAD76F3D101F0EBD282A7A794A29C3EF.pdf; Supplier: LCSC; Supply Voltage: 2.7V~3.6V; Resolution: 16; Operating Temperature: -40℃~+85℃
U3 = AS72651-BLGT: Supply Voltage:2.7V~3.6V Supply Voltage:2.7V~3.6V Resolution:16 Operating Temperature:-40℃~+85℃ Operating Temperature:-40℃~+85℃; LCSC Part Name: AS72651 BLGT; Supplier Part: C2654919; Manufacturer: AMS; Supplier Footprint: LGA-20; JLCPCB Part Class: Extended Part; Datasheet: https://atta.szlcsc.com/upload/public/pdf/source/20210417/CAD76F3D101F0EBD282A7A794A29C3EF.pdf; Supplier: LCSC; Supply Voltage: 2.7V~3.6V; Resolution: 16; Operating Temperature: -40℃~+85℃
U6 = AS72653-BLGT: Supply Voltage:2.7V~3.6V Supply Voltage:2.7V~3.6V Resolution:16 Operating Temperature:-40℃~+85℃ Operating Temperature:-40℃~+85℃; Supplier Part: C5554712; Manufacturer: ams(艾迈斯半导体); Supplier Footprint: BFLGA-20; JLCPCB Part Class: Extended Part; Datasheet: https://atta.szlcsc.com/upload/public/pdf/source/20240415/398A1FEB6318925A3A54D852B116A1DF.pdf; Supplier: LCSC; Supply Voltage: 2.7V~3.6V; Resolution: 16; Operating Temperature: -40℃~+85℃
U7 = AT25SF041B-SSHB-T: Interface Type:SPI Memory Size:4Mbit Supply Voltage:2.7V~3.6V Supply Voltage:2.7V~3.6V Operating Temperature:-40℃~+85℃ Operating Temperature:-40℃~+85℃; LCSC Part Name: AT25SF041B SSHB T; Supplier Part: C1870755; Manufacturer: Dialog/Adesto; Supplier Footprint: SOIC-8; JLCPCB Part Class: Extended Part; Datasheet: https://atta.szlcsc.com/upload/public/pdf/source/20210525/C1870755_8D3EB570C2E74951BAC5A925EC4F76CD.pdf; Supplier: LCSC; Interface Type: SPI; Memory Size: 4Mbit; Supply Voltage: 2.7V~3.6V; Operating Temperature: -40℃~+85℃
D6 D7 = 019-141-411-R: PARTREV: Rev 5/7/2019; MANUFACTURER: Advanced Photonix; MAXIMUM_PACKAGE_HEIGHT: 0.8mm; STANDARD: IPC 7351B
H25 = HDR-M_2.54_1x5P: Supplier Footprint: Through
J5-J8 = Small Pin TH
LED4 LED5 = KB_DDLM31.13-6D7E-25-24A4-140-R18
U23 = OPA323IDCKR

## Nets
+3.3V: C1.1 C2.1 C3.1 C4.1 C5.1 C6.1 C7.1 D1.2 H2.4 H4.2 H6.3 H10.4 H11.2 H14.4 H15.2 H18.1 H21.1 H23.1 J3.1 R9.1 R12.2 R13.1 R14.2 R15.1 R16.1 R17.1 R18.1 R26.1 R27.1 SW1.2 SW1.3 SW1.5 SW1.6 TB1.1 U2.14(VDD2) U2.17(VDD1) U3.14(VDD2) U3.17(VDD1) U6.14(VDD2) U6.17(VDD1) U7.8(VCC) U15.2 U17.1
+3.3V_EXT: H22.1 J2.1 R23.2 R24.2 R25.2
AGND: C9.2 D7.A H25.2 R41.2 U23.2(V-)
GND: C1.2 C2.2 C3.2 C4.2 C5.2 C6.2 C7.2 C8.2 D1.1 D2.1 D3.1 D4.1 D5.1 H2.5 H5.6 H6.4 H10.5 H14.5 H17.4 H21.5 H23.8 J4.1 LED2.1(K) Q1.2(GND) R19.2 R20.2 R21.2 R22.2 SCREW1.1 SCREW2.1 SCREW3.1 SCREW4.1 TB1.2 U2.16(GND) U3.16(GND) U6.16(GND) U7.4(GND) U18.1
VDD_PROG: C8.1 Q1.1(IN) U16.2
CSN_EE: H3.1 H5.5 H17.1 H23.2 U3.6(CSN) U7.1(CS#)
I2C_ENB: H3.3 R12.1 U3.8(I2C_ENB)
INT: H7.1 R10.1 U8.2
IR: H11.1 H21.3 U2.15(LED_DRV)
IR_2: H22.3 U4.1(-)
RESN: H1.2 H7.2 H23.6 Q1.3(OUT) R9.2 R29.2 U3.2(RESN)
RST-ADDR: R11.2 R28.2
RX/SCL_S: H4.5 H6.1 R18.2 R32.2 U3.11(RX/SCL_S)
SCL: D3.2 H9.4 H13.4 R7.1 R15.2 U2.9(SCL_M) U6.9(SCL_M) U9.1
SDA: D2.2 H9.5 H13.5 R8.1 R16.2 U2.10(SDA_M) U6.10(SDA_M) U10.2
SLV1_RESN: R26.2 U11.1 U13.1
SLV2_RESN: R27.2 U12.2 U14.1
SPI_MISO: H1.5 H5.1 H17.2 H23.3 U3.5(MISO) U7.2(SO(IO1))
SPI_MOSI: H1.4 H5.4 H18.4 H23.5 U3.4(MOSI) U7.5(SI(IO0))
SPI_SCK: H1.3 H5.3 H18.3 H23.4 U3.3(SCK) U7.6(SCK)
TX/SDA_S: H4.4 H6.2 R17.2 R31.2 U3.12(TX/SDA_S)
UV: H15.1 H21.4 U6.15(LED_DRV)
UV_2: H22.4 U5.2
VIS: H4.1 H21.2 U3.15(LED_DRV)
VIS_2: H22.2 LED3.2(C)
$1N690: LED1.2(A) R5.1
$1N692: LED2.2(A) R6.2
$1N694: R5.2 SW1.1
$1N699: R6.1 SW1.4
$1N8135: H3.2 U3.7(NC)
$1N8266: H2.2 U3.19(NC)
$1N8666: H9.3 U2.8(I2C_ENB)
$1N8674: H9.1 U2.6(CSN)
$1N8678: H8.1 U2.1(SLV1_RESN)
$1N8686: H8.3 U2.3(SCK)
$1N8690: H8.4 U2.4(MOSI)
$1N8698: H11.5 U2.11(RX/SCL_S)
$1N8702: H11.4 U2.12(TX/SDA_S)
$1N8706: H11.3 U2.13(INT)
$1N8718: H10.1 U2.20(SLV2_RESN)
$1N8722: H10.2 U2.19(NC)
$1N8726: H10.3 U2.18(LED_IND)
$1N8894: H13.3 U6.8(I2C_ENB)
$1N8902: H13.1 U6.6(CSN)
$1N8906: H12.1 U6.1(SLV1_RESN)
$1N8914: H12.3 U6.3(SCK)
$1N8918: H12.4 U6.4(MOSI)
$1N8926: H15.5 U6.11(RX/SCL_S)
$1N8930: H15.4 U6.12(TX/SDA_S)
$1N8934: H15.3 U6.13(INT)
$1N8946: H14.1 U6.20(SLV2_RESN)
$1N8950: H14.2 U6.19(NC)
$1N8954: H14.3 U6.18(LED_IND)
$1N9441: H2.3 LED1.1(K) U3.18(LED_IND)
$1N9987: H18.2 R13.2 U7.7(HOLD#(IO3))
$1N10119: H17.3 R14.1 U7.3(WP#(IO2))
$1N10752: H9.2 R20.1 U2.7(NC)
$1N10761: H8.5 R19.1 U2.5(MISO)
$1N11051: H13.2 R22.1 U6.7(NC)
$1N11053: H12.5 R21.1 U6.5(MISO)
$1N12565: H4.3 R11.1 U3.13(INT) U8.1
$1N12614: H3.4 R10.2 U3.9(SCL_M) U9.2
$1N12663: H3.5 U3.10(SDA_M) U10.1
$1N12744: H1.1 R8.2 U3.1(SLV1_RESN) U11.2
$1N14394: H2.1 R7.2 U3.20(SLV2_RESN) U12.1
$1N14584: H8.2 R28.1 U2.2(RESN) U13.2
$1N14688: H12.2 R29.1 U6.2(RESN) U14.2
$1N16398: D4.2 R31.1
$1N16437: D5.2 R32.1
$2N2411: LED3.1(A) R23.1
$2N2617: R24.1 U4.2(+)
$2N2776: R25.1 U5.1
$2N4159: H22.5 J1.1 SCREW5.1
$3N690: H5.2 R30.1 U15.1
$3N846: R30.2 U16.1
$4N474: H24.1 R34.1 U19.1(G)
$4N840: H24.3 R36.1 U20.1(G)
$4N848: H24.5 R38.1 U21.1(G)
$4N867: H24.2 R34.2 U19.2(S)
$4N881: H24.6 R38.2 U21.2(S)
$4N888: H24.4 R36.2 U20.2(S)
$4N1041: H16.1 R33.2
$4N1043: H16.3 R35.2
$4N1045: H16.5 R37.2
$4N1047: H16.7 R39.2
$4N1080: H16.2 R33.1 U19.3(D)
$4N1095: H16.4 R35.1 U20.3(D)
$4N1106: H16.6 R37.1 U21.3(D)
$4N1121: H16.8 R39.1 U22.3(D)
$4N1148: H24.7 R40.1 U22.1(G)
$4N1160: H24.8 R40.2 U22.2(S)
$5N412: J5.1 LED4.1(Cathode)
$5N415: J6.1 LED4.2(Anode)
$5N454: D6.A J7.1
$5N456: D6.K J8.1
$5N2282: C9.1 R41.1 R42.2 U23.1(IN+)
$5N2306: C10.1 D7.K R43.2 U23.3(IN-)
$5N2329: C10.2 H25.3 R43.1 U23.4(OUT)
$5N2356: H25.1 R42.1 U23.5(V+)
$5N2498: H25.4 LED5.1(Cathode)
$5N2505: H25.5 LED5.2(Anode)

Not connected (* = marked no-connect by the designer): H23 7*

## Notes on the sheets
sheet 1
- FLASH
sheet 3
- FLASH Programmer Auto-Reset
- FLASH Programmer Manual-Reset
- System Interface
- LED Interface
- External Supply

# Board PCB1
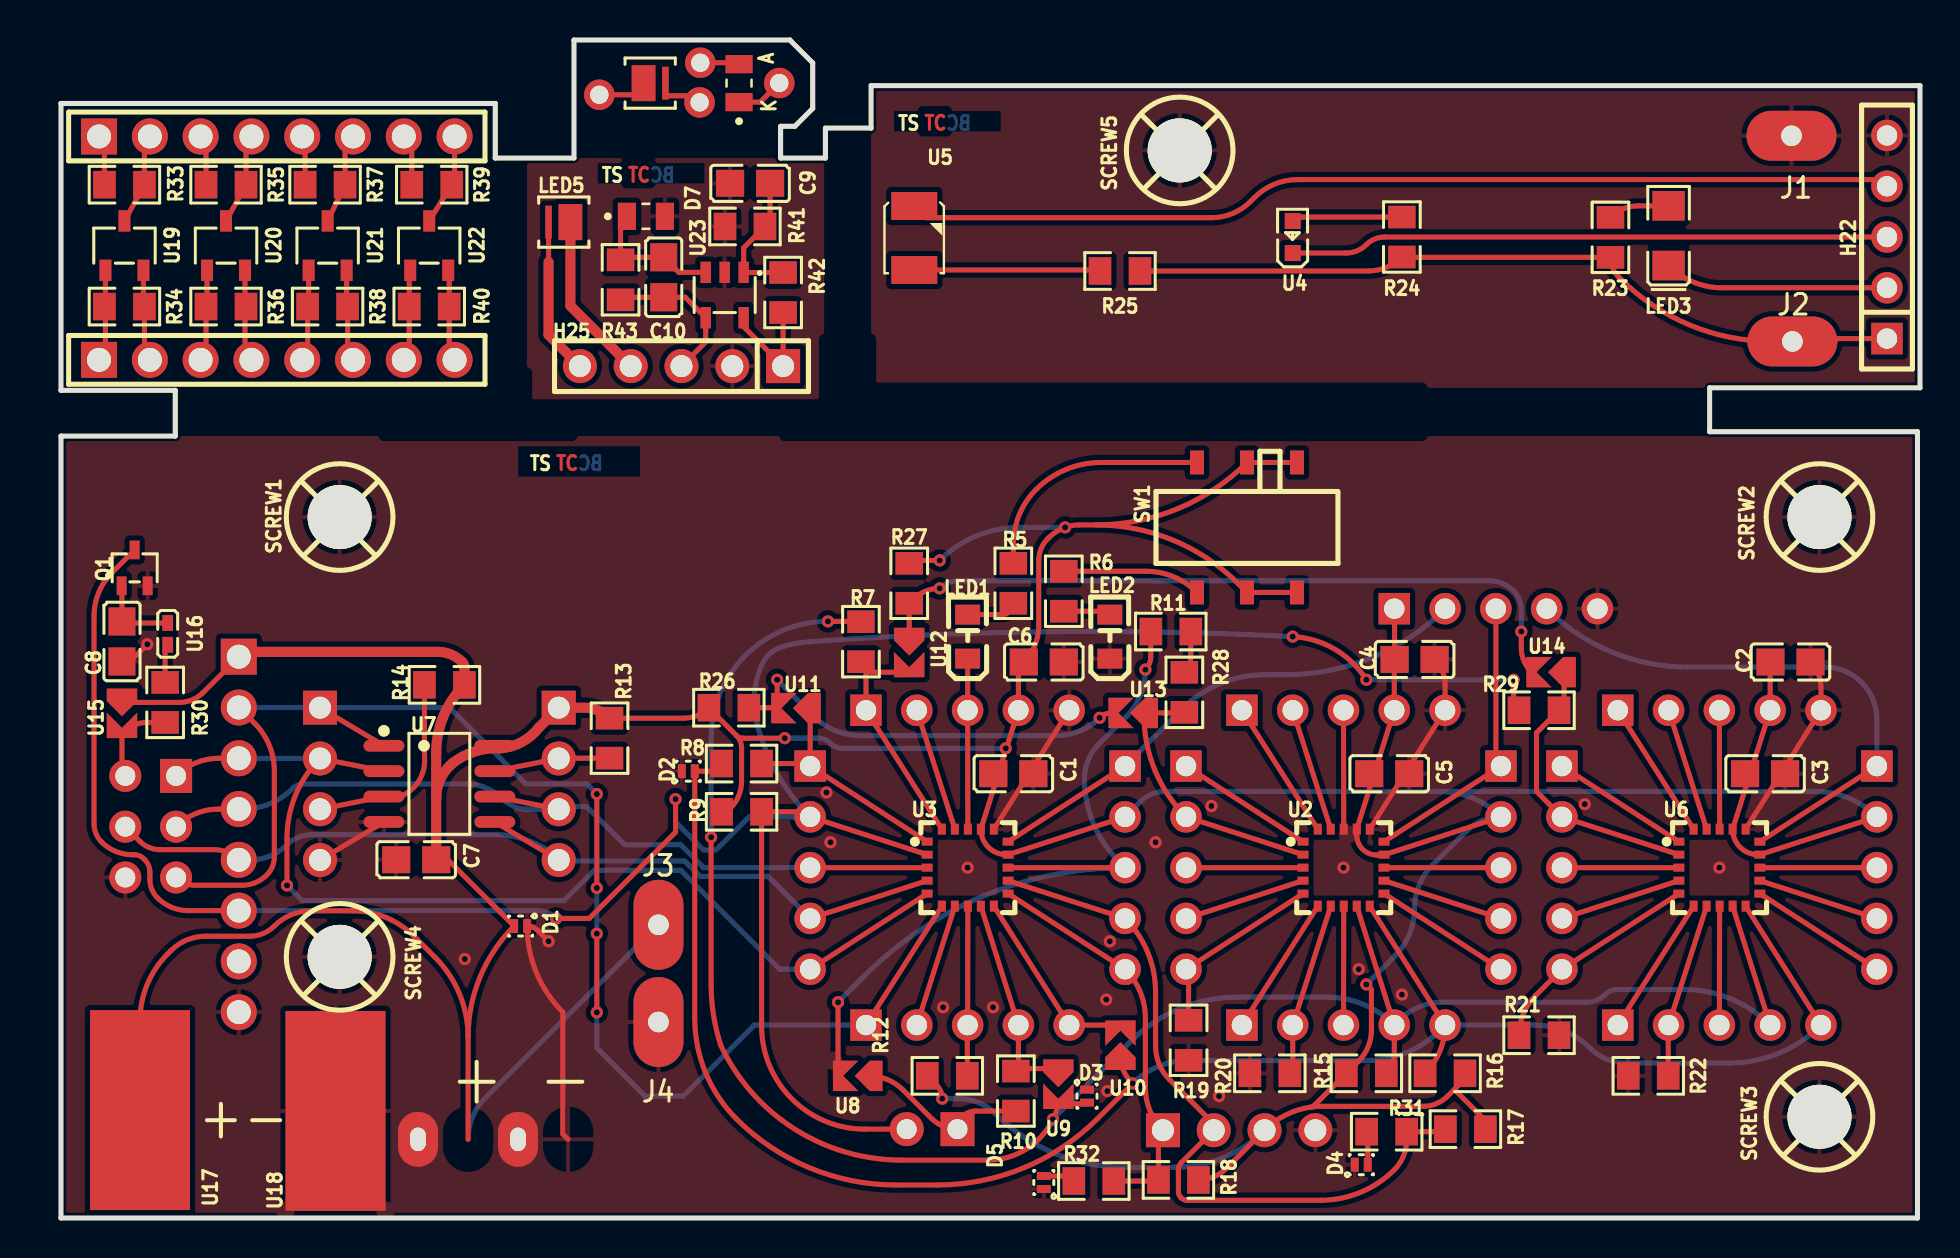
[diagram p5: board, top side]
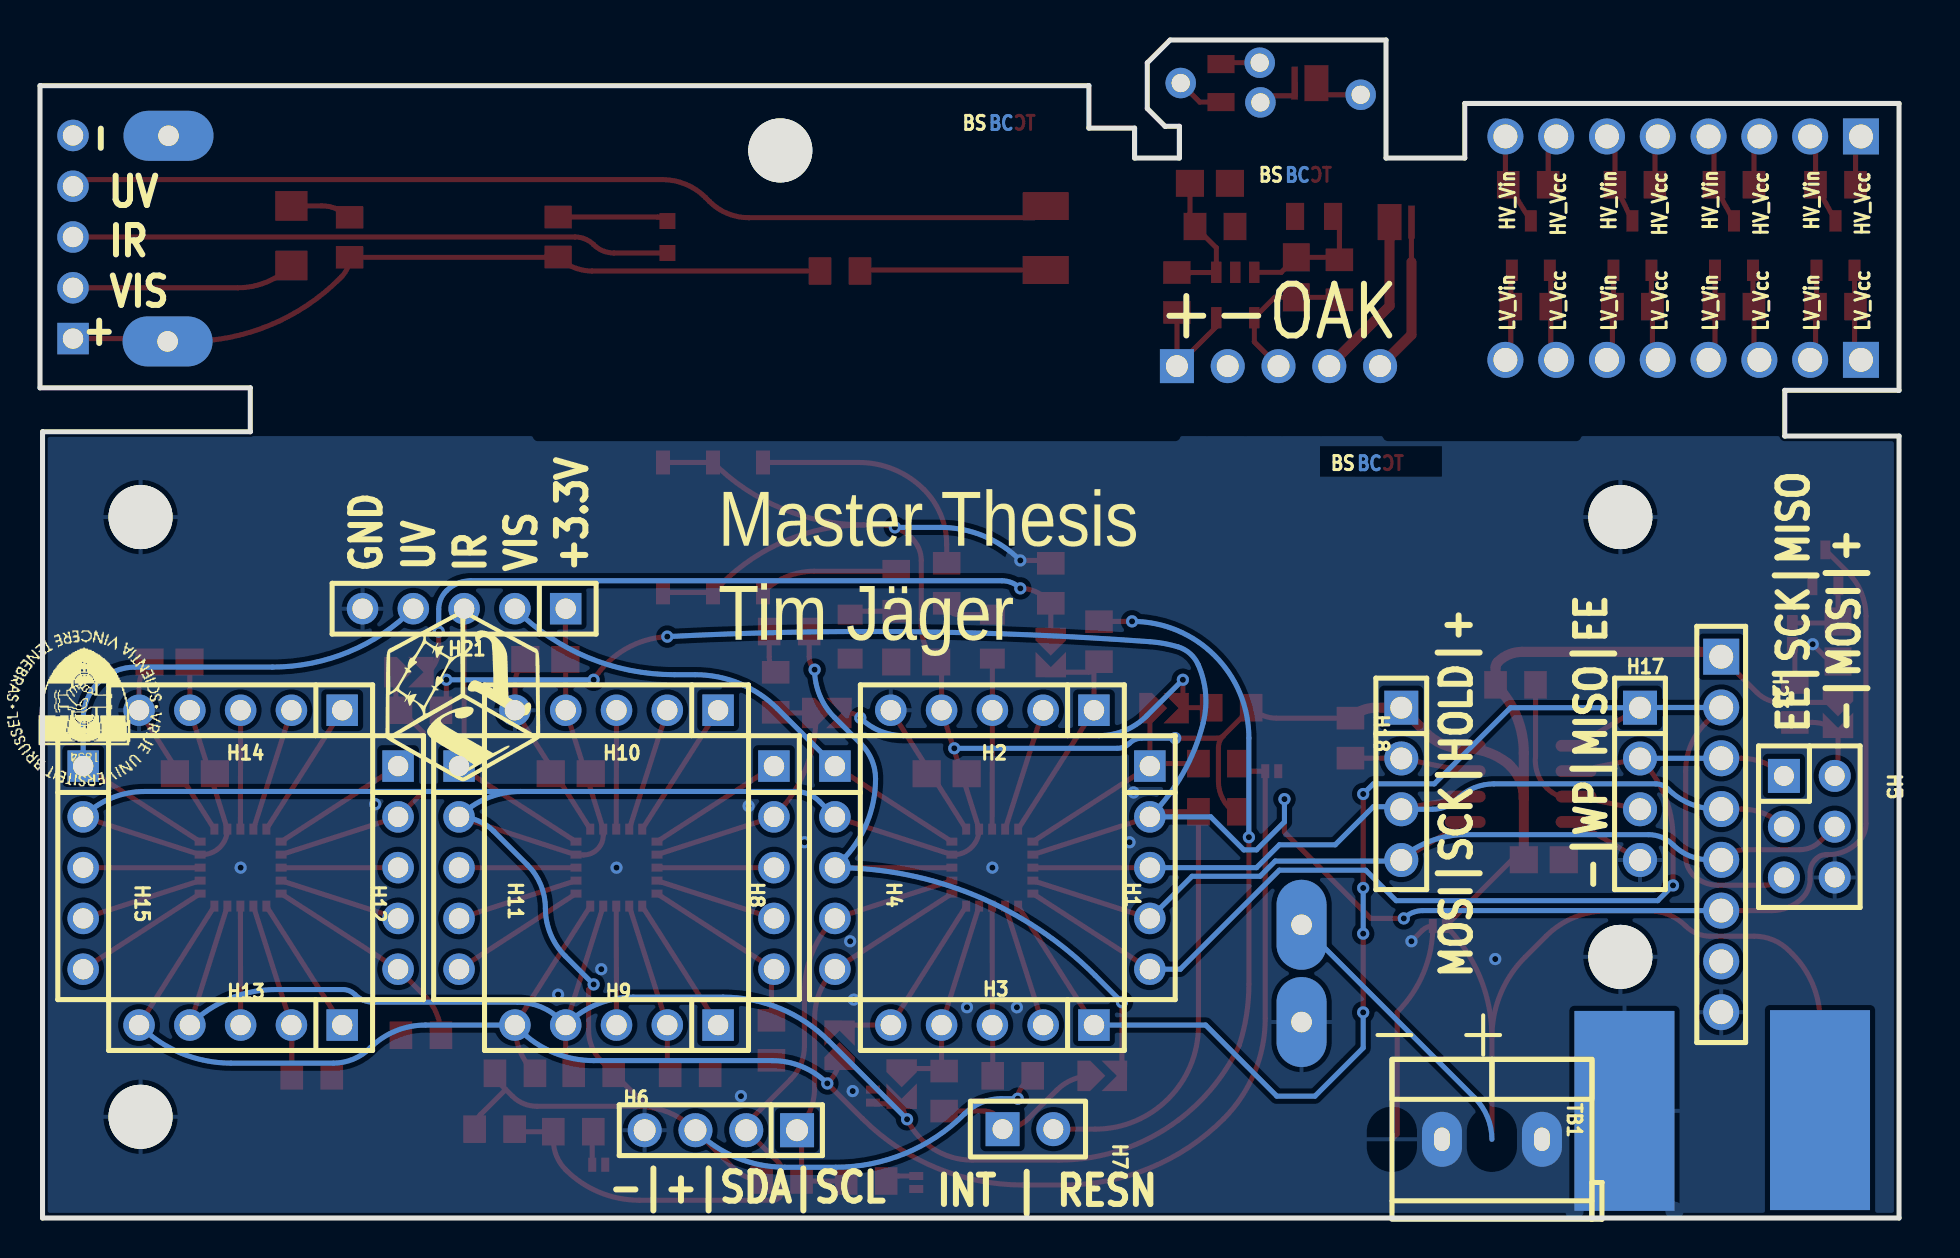
[diagram p6: board, bottom side, seen from below]

Outline 92.96 x 58.93 mm; copper layers: Top Layer, Bottom Layer. Coordinates in mm from the lower left corner of the outline.
Outline path: 0,55.75 0,41.4 5.72,41.4 5.72,39.12 0,39.12 0,0 92.84,0 92.84,39.33 82.45,39.33 82.45,41.53 92.96,41.53 92.96,56.64 40.51,56.64 40.51,54.52 38.23,54.52 38.23,53.02 35.99,53.02 35.99,54.61 36.7,54.61 37.59,55.5 37.59,57.79 36.45,58.93 25.65,58.93 25.65,53.02 21.72,53.02 21.72,55.75 0,55.75
Stack: Top Layer 0.035mm - / Dielectric1 1.51mm FR4 er 4.5 / Bottom Layer 0.035mm -

## Design rules (mm)
template: Custom Config
spacing copperThickness1oz (default): track to track 0.176, other pairs 0.176 to 0.3
spacing copperThickness2oz: track to track 0.203, other pairs 0.152 to 0.3
track width copperThickness1oz (default): min 0.127, default 0.254, max 2.54
track width copperThickness2oz: min 0.203, default 0.254, max 2.54
differential pair differentialPair (default): width min 0.127, default 0.254, max 2.54; gap min 0.152, default 0.152
via viaSize (default): diameter min 0.5, default 0.61, max 10; hole min 0.3, default 0.305, max 6.3

## Placement (name value [footprint] x y rotation side)
C1  1µF  [C0805]  47.63 22.23 0 top
C2  100nF  [C0805]  86.49 27.81 0 top
C3  1µF  [C0805]  85.22 22.23 0 top
C4  100nF  [C0805]  67.69 27.94 0 top
C5  1µF  [C0805]  66.42 22.23 0 top
C6  100nF  [C0805]  49.15 27.81 0 top
C7  1µF  [C0805]  17.76 17.92 180 top
C8  100nF  [C0805]  3.05 28.84 270 top
C9  1µF  [C0805]  34.46 51.76 180 top
C10  3.3pF  [C0805]  30.14 47.06 270 top
D1  UCLAMP3311T.TCT  [SLP1006P2T_L1.0-W0.6-P0.65-L]  22.99 14.61 180 top
D2  UCLAMP3311T.TCT  [SLP1006P2T_L1.0-W0.6-P0.65-L]  31.37 22.35 0 top
D3  UCLAMP3311T.TCT  [SLP1006P2T_L1.0-W0.6-P0.65-L]  51.31 6.1 270 top
D4  UCLAMP3311T.TCT  [SLP1006P2T_L1.0-W0.6-P0.65-L]  65.02 2.67 0 top
D5  UCLAMP3311T.TCT  [SLP1006P2T_L1.0-W0.6-P0.65-L]  49.15 1.78 90 top
D6  019-141-411-R  [DIOC2012X80N]  33.91 56.77 90 top
D7  019-141-411-R  [DIOC2012X80N]  29.25 50.11 0 top
H1  -  [HDR-TH_5P-P2.54-V-F]  37.47 17.53 270 bottom
H2  -  [HDR-TH_5P-P2.54-V-F]  45.34 25.4 0 bottom
H3  -  [HDR-TH_5P-P2.54-V-F]  45.34 9.65 0 bottom
H4  -  [HDR-TH_5P-P2.54-V-F]  53.21 17.53 270 bottom
H5  Flash  [HDR-TH_6P-P2.54-V-F-R2-C3-S2.54]  4.49 19.58 270 bottom
H6  -  [HDR-TH_4P-P2.54-V-M]  58.92 4.39 0 bottom
H7  -  [HDR-TH_2P-P2.54-V-F]  43.56 4.45 180 bottom
H8  -  [HDR-TH_5P-P2.54-V-F]  56.26 17.53 270 bottom
H9  -  [HDR-TH_5P-P2.54-V-F]  64.14 9.65 0 bottom
H10  -  [HDR-TH_5P-P2.54-V-F]  64.14 25.4 0 bottom
H11  -  [HDR-TH_5P-P2.54-V-F]  72.01 17.53 270 bottom
H12  -  [HDR-TH_5P-P2.54-V-F]  75.06 17.53 270 bottom
H13  -  [HDR-TH_5P-P2.54-V-F]  82.93 9.65 0 bottom
H14  -  [HDR-TH_5P-P2.54-V-F]  82.93 25.4 0 bottom
H15  -  [HDR-TH_5P-P2.54-V-F]  90.8 17.53 270 bottom
H16  HV  [HDR-TH_8P-P2.54-V-F-1]  10.8 54.1 0 top
H17  -  [HDR-TH_4P-P2.54-V-F]  12.95 21.72 270 bottom
H18  -  [HDR-TH_4P-P2.54-V-F]  24.89 21.72 270 bottom
H21  -  [HDR-TH_5P-P2.54-V-F]  71.76 30.48 0 bottom
H22  -  [HDR-TH_5P-P2.54-V-F]  91.31 49.07 90 top
H23  -  [HDR-TH_8P-P2.54-V-F-1]  8.89 19.19 270 bottom
H24  LV  [HDR-TH_8P-P2.54-V-F-1]  10.8 42.93 0 top
H25  -  [HDR-TH_5P-P2.54-V-M]  31.03 42.61 180 top
J1  -  [1 Pin TH]  86.54 54.14 90 top
J2  -  [1 Pin TH]  86.58 43.85 90 top
J3  -  [1 Pin TH]  29.88 14.67 0 top
J4  -  [1 Pin TH]  29.88 9.8 0 top
J5  -  [Small Pin TH]  26.92 56.19 0 top
J6  -  [Small Pin TH]  31.94 55.81 0 top
J7  -  [Small Pin TH]  31.97 57.79 0 top
J8  -  [Small Pin TH]  35.92 56.78 0 top
LED1  XL-2012SYGC  [LED0805-RD_GREEN]  45.34 29.08 90 top
LED2  XL-2012SURC  [LED0805-RD_RED]  52.45 29.08 90 top
LED3  HL-PC-3216H233W(6000-7000K)  [LED1206-R-RD_WHITE]  80.39 49.14 90 top
LED4  KB DDLM31.13-6D7E-25-24A4-140-R18  [LED_KB_DDLM31.13-6D7E-25-24A4-140-R18_OSR]  29.46 56.77 0 top
LED5  KB DDLM31.13-6D7E-25-24A4-140-R18  [LED_KB_DDLM31.13-6D7E-25-24A4-140-R18_OSR]  25.14 49.82 180 top
Q1  DTC113ZUA  [SOT-323-3_L2.0-W1.3-P1.30-LS2.1-BR]  3.69 32.52 270 top
R5  240Ω  [R0805]  47.63 31.75 90 top
R6  240Ω  [R0805]  50.15 31.35 270 top
R7  0Ω  [R0805]  40.01 28.83 270 top
R8  0Ω  [R0805]  34.04 22.73 0 top
R9  10kΩ  [R0805]  34.04 20.32 0 top
R10  0Ω  [R0805]  47.75 6.35 90 top
R11  0Ω  [R0805]  55.5 29.34 0 top
R12  10kΩ  [R0805]  44.32 7.11 180 top
R13  0Ω  [R0805]  27.43 24 270 top
R14  0Ω  [R0805]  19.18 26.67 0 top
R15  2.2kΩ  [R0805]  65.28 7.24 0 top
R16  2.2kΩ  [R0805]  69.22 7.24 180 top
R17  2.2kΩ  [R0805]  70.23 4.45 180 top
R18  2.2kΩ  [R0805]  55.88 1.91 180 top
R19  10kΩ  [R0805]  56.39 8.89 270 top
R20  10kΩ  [R0805]  60.45 7.24 180 top
R21  10kΩ  [R0805]  73.91 9.14 0 top
R22  10kΩ  [R0805]  79.38 7.11 180 top
R23  0Ω  [R0805]  77.49 49.06 270 top
R24  0Ω  [R0805]  67.06 49.07 270 top
R25  0Ω  [R0805]  52.96 47.37 0 top
R26  10kΩ  [R0805]  33.4 25.53 0 top
R27  10kΩ  [R0805]  42.42 31.75 270 top
R28  0Ω  [R0805]  56.18 26.3 90 top
R29  0Ω  [R0805]  73.91 25.4 180 top
R30  0Ω  [R0805]  5.21 25.79 90 top
R31  0Ω  [R0805]  66.29 4.32 0 top
R32  0Ω  [R0805]  51.65 1.85 0 top
R33  10kΩ  [R0805]  3.17 51.69 180 top
R34  10kΩ  [R0805]  3.17 45.59 0 top
R35  10kΩ  [R0805]  8.26 51.69 180 top
R36  10kΩ  [R0805]  8.26 45.59 0 top
R37  10kΩ  [R0805]  13.21 51.69 180 top
R38  10kΩ  [R0805]  13.34 45.59 0 top
R39  10kΩ  [R0805]  18.54 51.69 180 top
R40  10kΩ  [R0805]  18.42 45.59 0 top
R41  280Ω  [R0805]  34.21 49.6 180 top
R42  13.7kΩ  [R0805]  36.11 46.3 90 top
R43  2MΩ  [R0805]  27.98 46.93 90 top
SCREW1  -  [Screw-Hole-M3]  14 35 0 top
SCREW2  -  [Screw-Hole-M3]  88 35 0 top
SCREW3  -  [Screw-Hole-M3]  88 5 0 top
SCREW4  -  [Screw-Hole-M3]  14 13 0 top
SCREW5  -  [Screw-Hole-M3]  56.01 53.34 0 top
SW1  SK-3245S-L3-B  [SW-SMD_SK-3245S-L3-B]  59.31 34.54 0 top
TB1  -  [DG126 5-2]  22.86 3.94 0 bottom
U2  AS72652-BLGT  [LGA-20_L4.7-W4.5-P0.65-TL-1]  64.14 17.53 0 top
U3  AS72651-BLGT  [LGA-20_L4.7-W4.5-P0.65-TL-1]  45.34 17.53 0 top
U4  MHT192IR128CT  [LED0603-RD]  61.6 49.07 90 top
U5  VLMU3100-GS08  [LED-SMD_L3.2-W2.8-LS3.5-FD]  42.67 49.02 90 top
U6  AS72653-BLGT  [LGA-20_L4.7-W4.5-P0.65-TL-1]  82.93 17.53 0 top
U7  AT25SF041B-SSHB-T  [SOIC-8_L4.9-W3.9-P1.27-LS6.0-BL]  18.92 21.72 270 top
U8  -  [Open Solder Jumper]  39.12 7.11 0 top
U9  -  [Open Solder Jumper]  49.87 5.97 90 top
U10  -  [Open Solder Jumper]  52.98 9.37 270 top
U11  -  [Open Solder Jumper]  36.03 25.5 0 top
U12  -  [Open Solder Jumper]  42.42 27.56 90 top
U13  -  [Open Solder Jumper]  52.89 25.26 0 top
U14  -  [Open Solder Jumper]  73.79 27.31 0 top
U15  -  [Open Solder Jumper]  3.05 24.52 90 top
U16  7427927161  [L0402]  5.34 29.22 90 top
U17  -  [Clamp Pad]  3.95 5.4 90 top
U18  -  [Clamp Pad]  13.73 5.36 90 top
U19  BSS138  [SOT-23-3_L2.9-W1.6-P1.90-LS2.8-BR]  3.17 48.64 270 top
U20  BSS138  [SOT-23-3_L2.9-W1.6-P1.90-LS2.8-BR]  8.26 48.64 270 top
U21  BSS138  [SOT-23-3_L2.9-W1.6-P1.90-LS2.8-BR]  13.34 48.64 270 top
U22  BSS138  [SOT-23-3_L2.9-W1.6-P1.90-LS2.8-BR]  18.42 48.64 270 top
U23  OPA323IDCKR  [SC70-5_DCK_TEX]  33.19 46.17 180 top

## Footprints (pads in the part's own frame, mm; a bottom-side part is the same pattern mirrored in y, then rotated)
1 Pin TH
  oval 2.5x4.5 hole 1.032: 1(0,0)
C0805
  rect 1.41x1.35 smd: 1(-1,0) 2(1,0)
Clamp Pad
  rect 10x5 smd: 1(0,0)
  rect 10x5 smd far side: 1(0,0)
DG126 5-2
  oval 2x2.75 hole 0.778x1.178: 1(-5.003,0) 2(-0.004,0)
DIOC2012X80N
  rect 0.91x1.36 smd: A(0.95,0) K(-0.95,0)
HDR-TH_2P-P2.54-V-F
  rect 1.7x1.7 hole 1: 1(-1.27,0)
  round 1.7 hole 1: 2(1.27,0)
HDR-TH_4P-P2.54-V-F
  rect 1.7x1.7 hole 1.1: 1(-3.81,0)
  round 1.7 hole 1.1: 2(-1.27,0) 3(1.27,0) 4(3.81,0)
HDR-TH_4P-P2.54-V-M
  rect 1.7x1.7 hole 1.1: 1(-3.81,0)
  round 1.7 hole 1.1: 2(-1.27,0) 3(1.27,0) 4(3.81,0)
HDR-TH_5P-P2.54-V-F
  rect 1.575x1.575 hole 1.02: 1(-5.08,0)
  round 1.575 hole 1.02: 2(-2.54,0) 3(0,0) 4(2.54,0) 5(5.08,0)
HDR-TH_5P-P2.54-V-M
  rect 1.7x1.7 hole 1.1: 1(-5.08,0)
  round 1.7 hole 1.1: 2(-2.54,0) 3(0,0) 4(2.54,0) 5(5.08,0)
HDR-TH_6P-P2.54-V-F-R2-C3-S2.54
  rect 1.7x1.6 hole 1: 1(-2.54,-1.27)
  round 1.6 hole 1: 2(-2.54,1.27) 3(0,-1.27) 4(0,1.27) 5(2.54,-1.27) 6(2.54,1.27)
HDR-TH_8P-P2.54-V-F-1
  rect 1.8x1.8 hole 1.2: 1(-8.89,0)
  round 1.8 hole 1.2: 2(-6.35,0) 3(-3.81,0) 4(-1.27,0) 5(1.27,0) 6(3.81,0) 7(6.35,0) 8(8.89,0)
L0402
  rect 0.79x0.54 smd: 1(-0.545,0) 2(0.545,0)
LED0603-RD
  rect 0.8x0.8 smd: 1(-0.799,0) 2(0.799,0)
LED0805-RD_GREEN
  rect 1x1.25 smd: 1(-1.1,0) 2(1.1,0)
LED0805-RD_RED
  rect 1x1.25 smd: 1(-1.1,0) 2(1.1,0)
LED1206-R-RD_WHITE
  rect 1.485x1.62 smd: 1(1.492,0) 2(-1.492,0)
LED-SMD_L3.2-W2.8-LS3.5-FD
  rect 1.4x2.3 smd: 1(-1.6,0) 2(1.6,0)
LED_KB_DDLM31.13-6D7E-25-24A4-140-R18_OSR
  rect 1.194x1.804 smd: 1(-0.33,0)
  rect 0.33x1.651 smd: 2(0.762,0)
LGA-20_L4.7-W4.5-P0.65-TL-1
  rect 0.55x0.4 smd: 1(-2.025,1.3) 2(-2.025,0.65) 3(-2.025,0) 4(-2.025,-0.65) 5(-2.025,-1.3) 11(2.025,-1.3) 12(2.025,-0.65) 13(2.025,0) 14(2.025,0.65) 15(2.025,1.3)
  rect 0.4x0.55 smd: 6(-1.288,-1.925) 7(-0.637,-1.925) 8(0.013,-1.925) 9(0.662,-1.925) 10(1.312,-1.925) 16(1.312,1.925) 17(0.662,1.925) 18(0.013,1.925) 19(-0.637,1.925) 20(-1.288,1.925)
Open Solder Jumper
  custom 1.28x1.524 smd: 1(-0.257,0)
  custom 1.397x1.524 smd: 2(1.27,0)
R0805
  rect 1.133x1.377 smd: 1(-1,0) 2(1,0)
SC70-5_DCK_TEX
  rect 0.524x1.07 smd: 1(-0.95,-1.135) 2(0,-1.135) 3(0.95,-1.135) 4(0.95,1.135) 5(-0.95,1.135)
Screw-Hole-M3
  round 3.2 hole 3.2: 1(-0.064,0.064)
SLP1006P2T_L1.0-W0.6-P0.65-L
  rect 0.4x0.7 smd: 1(-0.325,0) 2(0.325,0)
Small Pin TH
  round 1.524 hole 0.914: 1(0,0)
SOIC-8_L4.9-W3.9-P1.27-LS6.0-BL
  oval 0.588x2.045 smd: 1(-1.905,-2.772) 2(-0.635,-2.772) 3(0.635,-2.772) 4(1.905,-2.772) 5(1.905,2.772) 6(0.635,2.772) 7(-0.635,2.772) 8(-1.905,2.772)
SOT-23-3_L2.9-W1.6-P1.90-LS2.8-BR
  rect 1.07x0.6 smd: 1(1.235,-0.95) 2(1.235,0.95) 3(-1.235,0)
SOT-323-3_L2.0-W1.3-P1.30-LS2.1-BR
  rect 0.936x0.5 smd: 1(0.898,-0.65) 2(0.898,0.65) 3(-0.898,0)
SW-SMD_SK-3245S-L3-B
  rect 0.7x1.2 smd: 1(-2.5,3.25) 2(0,3.25) 3(2.5,3.25) 4(-2.5,-3.25) 5(0,-3.25) 6(2.499,-3.25)

## Nets
As in the schematic.

Pads without a net: H23 7

## Via types
v1: diameter 0.61, hole 0.305, Top Layer to Bottom Layer, 45 vias

## Routing (per net, layer and track width the routed paths; a pad name or vN(x,y) marks a point on that pad's centre or on a via; arc(x,y) is an arc through that point)
+3.3V: length 313
  Top Layer w0.254: U15.2 5.91,25.79 arc(6.56,25.92) 7.11,26.29 8.89,28.07 arc(8.89,28.07) H23.1 ; U17.1 3.95,9.87 arc(4.31,11.68) 5.33,13.21 5.5,13.38 arc(6.3,13.91) 7.24,14.1 9.44,14.1 arc(10.11,14.23) 10.67,14.61 arc(11.51,15.17) 12.51,15.37 14.59,15.37 arc(16.25,15.04) 17.65,14.1 18.7,13.05 arc(19.93,11.21) 20.36,9.05 ; 66.14,18.16 66.15,18.16 ; 66.14,18.16 65.79,18.16 arc(65.09,18.45) 64.8,19.15 U2.17 H10.4 66.67,27.9 arc(66.68,27.92) C4.1 66.69,30.44 arc(66.69,30.46) H21.1 ; 66.14,18.16 arc(66.15,18.16) 66.15,18.16 ; 66.15,18.16 H11.2 ; 66.15,18.16 arc(66.16,18.17) U2.14 ; 20.36,3.94 20.36,9.05 ; 20.36,9.05 arc(20.96,12.06) D1.2 19.34,17.92 C7.1 ; 33.78,24.13 32.41,25.5 arc(32.4,25.51) R26.1 arc(31.82,25.14) 31.14,25 R13.1 ; 33.78,24.13 arc(33.97,23.85) 34.04,23.52 34.04,21.84 arc(33.89,21.13) 33.49,20.52 33.23,20.52 R9.1 ; 33.78,24.13 arc(33.92,24.04) 34.09,24 v1(36.2,24) ; 69.68,6.43 70.92,5.18 arc(71.15,4.85) R17.1 ; 69.68,6.43 69.34,6.1 arc(68.78,5.72) 68.12,5.59 63.07,5.59 arc(62.81,5.58) 62.55,5.55 ; 69.68,6.43 70.02,6.78 arc(70.17,6.99) R16.1 ; H4.2 U3.14 47.28,18.18 arc(46.37,18.55) U3.17 H2.4 47.88,27.16 arc(47.95,27.51) C6.1 arc(48.7,28.64) 48.89,29.61 48.89,32.89 arc(49.01,33.48) 49.34,33.98 49.4,34.04 arc(49.78,34.34) v1(50.21,34.55) arc(50.57,34.64) 50.94,34.67 51.77,34.67 ; SW1.3 SW1.2 arc(55.85,35.48) 51.77,34.67 ; R12.2 43.79,6.65 arc(44,6.34) v1(44.07,5.97) ; SW1.6 SW1.5 58.88,31.73 arc(55.62,33.91) 51.77,34.67 ; 65.35,11.62 65.53,11.43 65.53,9.4 arc(65.37,8.56) 64.89,7.85 R15.1 62.65,5.61 arc(62.61,5.58) 62.55,5.55 ; H15.2 U6.14 84.87,18.18 arc(83.97,18.55) U6.17 H14.4 85.47,27.77 arc(85.48,27.8) C2.1 ; v1(43.94,32.89) 42.76,32.89 arc(42.58,32.86) R27.1 ; 62.55,5.55 arc(62.52,5.55) 62.49,5.55 arc(61.25,5.16) H6.3 58.28,2.48 arc(57.64,2.06) R18.1
  Top Layer w0.508: C7.1 18.76,21 ; 18.76,21 18.76,23.26 arc(19.13,25.1) R14.2 20.18,27.55 arc(20.15,27.69) 20.07,27.81 arc(19.5,28.19) 18.84,28.32 9.48,28.32 arc(9.16,28.26) H23.1 ; 18.76,21 arc(18.94,21.87) 19.43,22.61 19.56,22.74 arc(20.69,23.34) 21.95,23.5 arc(23.04,23.81) 23.9,24.54 H18.1 26.17,25.53 arc(26.85,25.39) R13.1
  Bottom Layer w0.254: 68.94,21.34 87.74,21.34 arc(89.4,21.01) H15.2 ; 68.94,21.34 55.2,21.34 arc(54.54,21.2) 53.98,20.83 H4.2 ; 68.94,21.34 arc(70.6,21.01) H11.2 arc(71.07,19.88) 70.27,19.35 68.59,17.66 arc(67.92,16.67) 67.69,15.49 arc(67.43,14.2) 66.7,13.11 v1(65.28,11.68) ; v1(36.2,24) 37.87,24 arc(38.2,23.94) 38.48,23.75 arc(38.76,23.56) 39.09,23.5 v1(47.24,23.5) ; v1(44.07,5.97) 44.9,5.97 arc(45.89,5.77) 46.74,5.21 arc(49.69,3.23) 53.17,2.54 55.71,2.54 arc(58.13,3.02) H6.3 ; v1(50.21,34.55) 47.94,34.55 arc(45.77,34.12) v1(43.94,32.89) ; J3.1 21.22,6.01 arc(20.58,5.06) 20.36,3.94
+3.3V_EXT: length 39.1
  Top Layer w0.254: R25.2 65.36,47.37 arc(66.28,47.55) R24.2 arc(67.07,48.06) 67.09,48.06 R23.2 arc(77.59,47.53) 77.89,47.08 77.98,46.99 arc(81.46,44.67) 85.56,43.85 J2.1 arc(86.74,43.95) 86.93,43.99 H22.1
GND: length 44.3
  Top Layer w0.254: v1(4.32,28.7) 3.74,28.13 arc(3.42,27.91) C8.2 ; v1(24.38,13.84) 23.84,14.39 arc(23.6,14.55) D1.1 arc(23.78,12.27) 25.1,10.3 25.1,4.2 25.36,3.94 ; U2.16 H10.5 69.22,26.68 arc(69.08,27.36) C4.2 ; U6.16 H14.5 88.01,26.55 arc(87.87,27.23) C2.2 ; U7.4 H17.4 ; U3.16 H2.5
  vias: v1(20.19,12.95) v1(38.28,21.29) v1(38.48,18.8) v1(44.11,10.54) v1(45.34,17.53) v1(46.61,10.54) v1(52.27,10.93) v1(52.32,6.35) v1(52.45,13.84) v1(54.74,18.8) v1(57.53,20.61) v1(57.91,6.1) v1(64.14,17.53) v1(64.9,12.45) v1(67.06,11.18) v1(76.2,20.7) v1(82.93,17.53)
VDD_PROG: length 4.1
  Top Layer w0.254: U16.2 3.23,29.77 arc(3.13,29.78) C8.1 3.05,31.28 arc(3.08,31.45) Q1.1
CSN_EE: length 73.4
  Top Layer w0.254: U3.6 H3.1 ; v1(26.8,16.51) v1(26.8,21.21) ; v1(26.8,10.29) v1(26.8,14.22) ; H17.1 U7.1 ; H23.2 9.68,24.75 arc(10.41,23.65) 10.67,22.36 10.67,18.08 arc(10.57,17.58) 10.29,17.16 arc(9.73,16.78) 9.06,16.65 6.69,16.65 arc(6.19,16.75) H5.5
  Bottom Layer w0.254: v1(26.8,10.29) 26.8,8.51 29.21,6.1 31.11,6.1 34.67,9.65 H3.1 ; 12.98,25.4 13.21,25.4 arc(13.1,25.48) 12.98,25.53 ; v1(26.8,21.21) 26.29,21.72 23.24,21.72 19.43,25.53 12.98,25.53 ; H23.2 12.93,25.54 arc(12.96,25.53) 12.98,25.53 ; v1(26.8,14.22) v1(26.8,16.51)
I2C_ENB: length 8.5
  Top Layer w0.254: R12.1 45.32,9.64 arc(45.33,9.65) H3.3 U3.8
INT: length 8.8
  Top Layer w0.254: R10.1 45.74,5.35 arc(45.1,5.08) H7.1 arc(44.13,4.59) 43.53,4.98 42.12,6.39 arc(41.32,6.93) U8.2
IR: length 14.9
  Top Layer w0.254: U2.15 H11.1 arc(71.82,22.89) 71.76,23.22 H21.3
IR_2: length 29.9
  Top Layer w0.254: U4.1 64.27,48.27 arc(64.81,48.38) 65.28,48.69 arc(65.7,48.97) 66.2,49.07 H22.3
RESN: length 137.1
  Top Layer w0.254: Q1.3 2.56,32.29 arc(1.89,31.29) 1.65,30.11 1.65,19.73 arc(1.75,19.23) 2.04,18.81 arc(2.74,18.34) 3.57,18.17 3.69,18.17 arc(3.92,18.12) 4.12,17.99 4.19,17.92 arc(4.38,17.64) 4.45,17.3 4.45,16.93 arc(4.55,16.43) 4.83,16.01 arc(5.53,15.54) 6.36,15.38 H23.6 ; v1(30.73,20.96) 30.73,19.3 26.42,14.99 v1(24.77,14.99) ; H7.2 40.2,4.45 arc(36.55,5.96) 35.04,9.61 R9.2 37.21,20.32 H1.2 U3.2 ; v1(72.64,26.92) 72.64,26.05 arc(72.71,25.7) R29.2 ; v1(61.6,29.08) arc(63.7,28.45) v1(65.28,26.92)
  Bottom Layer w0.254: v1(65.28,26.92) v1(72.64,26.92) ; v1(30.73,20.96) 30.73,19.81 32.13,18.42 32.77,18.42 34.42,20.07 H1.2 arc(35.81,22.23) 34.8,24.77 arc(34.68,26.25) 35.05,27.69 arc(35.46,28.24) 36.07,28.58 arc(36.76,28.74) 37.47,28.83 arc(49.53,29.33) v1(61.6,29.08) ; H23.6 23.82,15.38 arc(24.33,15.28) v1(24.77,14.99)
RST-ADDR: length 2.1
  Top Layer w0.254: R11.2 56.5,28.08 arc(56.42,27.65) R28.2
RX/SCL_S: length 20.3
  Top Layer w0.254: R32.2 54.75,1.85 arc(54.82,1.86) R18.2 54.88,3.84 arc(54.94,4.14) H6.1 arc(54.46,5.36) 54.23,6.51 54.23,9.99 arc(53.96,11.32) H4.5 U3.11
SCL: length 102.6
  Top Layer w0.254: U6.9 H13.4 ; v1(38.35,29.85) 39.99,29.85 arc(40,29.84) R7.1 ; v1(32.51,19.05) 32.51,11.68 arc(32.63,10.14) 33,8.64 arc(34.29,6.59) 36.03,4.9 arc(38.87,3.41) 42.04,2.9 46.36,2.9 arc(48.27,3.45) v1(49.61,4.94) arc(49.76,5.32) U9.1 51.17,5.71 arc(51.24,5.73) D3.2 ; U2.9 H9.4 66.67,8.2 arc(66.57,7.68) R15.2
  Bottom Layer w0.254: v1(49.61,4.94) 53.53,8.87 arc(55.95,10.48) 58.8,11.05 63.3,11.05 arc(65.13,10.69) H9.4 66.92,9.9 arc(67.91,10.56) 69.09,10.8 76.3,10.8 arc(76.79,10.89) 77.22,11.18 arc(77.5,11.36) 77.83,11.43 81.18,11.43 arc(83.5,10.97) H13.4 ; v1(32.51,19.05) 32.51,24 arc(34.22,28.13) v1(38.35,29.85)
SDA: length 96.4
  Top Layer w0.254: U2.10 H9.5 arc(68.96,8.35) 68.22,7.24 ; H13.5 U6.10 ; 52.96,8.08 arc(52.97,8.09) U10.2 arc(53.12,7.4) 53.52,6.81 v1(53.59,6.73) 51.84,4.97 arc(48.16,2.51) 43.82,1.65 41.75,1.65 arc(37.44,2.51) 33.78,4.95 arc(32.24,7.27) 31.69,9.99 D2.2 32.66,22.35 32.78,22.48 arc(32.96,22.55) R8.1
  Bottom Layer w0.254: v1(53.59,6.73) arc(54.86,7.58) 56.35,7.87 65.28,7.87 arc(67.27,8.27) 68.96,9.4 H9.5 73.69,9.65 arc(75.19,9.35) 76.45,8.51 arc(77.3,7.95) 78.29,7.75 83.41,7.75 arc(85.9,8.24) H13.5
SLV1_RESN: length 20.9
  Top Layer w0.254: v1(35.81,26.92) 35.81,25.6 arc(35.8,25.55) U11.1 35.75,25.53 R26.2 ; U13.1 52.54,25.26 arc(52.22,25.2) v1(51.94,25.02)
  Bottom Layer w0.254: v1(35.81,26.92) 37.62,25.12 arc(38.71,24.39) 40.01,24.13 49.8,24.13 arc(50.96,24.36) v1(51.94,25.02)
SLV2_RESN: length 36.9
  Top Layer w0.254: v1(73.02,29.34) 73.02,28.53 arc(73.16,27.87) U14.1 ; U12.2 R27.2 42.61,30.95 arc(43.22,31.35) v1(43.94,31.5)
  Bottom Layer w0.254: v1(73.02,29.34) 73.02,30.45 arc(72.93,30.95) 72.64,31.37 arc(72.08,31.74) 71.42,31.88 44.86,31.88 arc(44.36,31.78) v1(43.94,31.5)
SPI_MISO: length 53.9
  Top Layer w0.254: U3.5 H1.5 ; v1(11.3,16.64) 11.3,19 arc(11.73,21.16) H17.2 U7.2 ; H23.3 7.89,23 arc(6.73,22.77) 5.76,22.12
  Bottom Layer w0.254: v1(11.3,16.64) 12.06,15.88 25.15,15.88 26.67,17.4 30.99,17.4 35.94,12.45 H1.5 ; H23.3 12.93,23 arc(13.08,22.95) 13.21,22.86
SPI_MOSI: length 46.7
  Top Layer w0.254: U7.5 H18.4 ; U3.4 H1.4 ; H5.4 3.95,18.84 arc(4.41,18.53) 4.96,18.43 7.67,18.43 arc(8.33,18.29) H23.5
  Bottom Layer w0.254: H18.4 24.94,17.86 25.06,17.86 ; 25.06,17.86 31.19,17.86 31.95,17.1 35.36,17.1 H1.4 ; 25.06,17.86 arc(25.04,17.88) 25.01,17.91 arc(23.53,18.82) 21.83,19.18 12.53,19.18 arc(11.87,19.04) 11.3,18.67 arc(10.47,18.11) 9.49,17.92 H23.5
SPI_SCK: length 43
  Top Layer w0.254: H23.4 7.89,20.46 arc(6.73,20.23) H5.3 ; U7.6 H18.3 ; U3.3 H1.3
  Bottom Layer w0.254: H1.3 32.13,17.53 30.99,18.67 28.19,18.67 26.29,20.57 25.02,20.57 H18.3 23.32,20.45 arc(22.66,20.58) 22.1,20.96 arc(21.25,21.52) 20.26,21.72 12.17,21.72 arc(11.84,21.65) 11.56,21.46 arc(10.44,20.72) 9.13,20.46 H23.4
TX/SDA_S: length 37.5
  Top Layer w0.254: U3.12 H4.4 arc(54.34,13.3) 54.74,11.31 54.74,8.6 arc(54.92,7.69) 55.43,6.93 57.42,4.93 arc(57.59,4.69) H6.2 56.03,2.78 arc(55.92,2.61) 55.88,2.41 55.88,1.32 arc(55.91,1.16) 56.01,1.02 arc(56.15,0.92) 56.31,0.89 63,0.89 arc(64.99,1.29) 66.67,2.41 arc(67.13,3.1) 67.29,3.91 R31.2 68.92,4.32 arc(69.09,4.35) R17.2
UV: length 28.1
  Top Layer w0.254: U6.15 H15.1
  Bottom Layer w0.254: H15.1 90.8,24.96 arc(90.61,25.95) 90.04,26.8 arc(89.2,27.36) 88.2,27.56 81.35,27.56 arc(77.53,28.32) H21.4
UV_2: length 49.5
  Top Layer w0.254: U5.2 43.26,50.04 57.53,50.04 arc(58.59,50.25) 59.48,50.85 59.69,51.05 arc(60.67,51.71) 61.84,51.94 90.51,51.94 arc(90.95,51.86) H22.4
VIS: length 25.5
  Top Layer w0.254: U3.15 H4.1
  Bottom Layer w0.254: H4.1 56.08,25.47 arc(57.97,26.73) 60.2,27.18 61.24,27.18 arc(65.56,28.04) H21.2
VIS_2: length 11.2
  Top Layer w0.254: H22.2 83.08,46.53 arc(81.62,46.82) LED3.2
$1N690: length 2.6
  Top Layer w0.254: LED1.2 47.06,30.18 arc(47.46,30.35) R5.1
$1N692: length 2.4
  Top Layer w0.254: R6.2 52.28,30.35 arc(52.4,30.3) LED2.2
$1N694: length 12.4
  Top Layer w0.254: R5.2 47.63,33.69 arc(47.92,35.18) 48.77,36.45 arc(50.26,37.44) 52.02,37.79 SW1.1
$1N699: length 6.9
  Top Layer w0.254: R6.1 54.25,32.35 arc(55.64,32.08) SW1.4
$1N8135: length 6.2
  Top Layer w0.254: U3.7 H3.2
$1N8266: length 6.2
  Top Layer w0.254: U3.19 H2.2
$1N8666: length 5.9
  Top Layer w0.254: H9.3 U2.8
$1N8674: length 7.1
  Top Layer w0.254: H9.1 U2.6
$1N8678: length 7
  Top Layer w0.254: H8.1 U2.1
$1N8686: length 5.8
  Top Layer w0.254: H8.3 U2.3
$1N8690: length 6.1
  Top Layer w0.254: H8.4 U2.4
$1N8698: length 7
  Top Layer w0.254: U2.11 H11.5
$1N8702: length 6.1
  Top Layer w0.254: H11.4 U2.12
$1N8706: length 5.8
  Top Layer w0.254: U2.13 H11.3
$1N8718: length 7.1
  Top Layer w0.254: U2.20 H10.1
$1N8722: length 6.2
  Top Layer w0.254: U2.19 H10.2
$1N8726: length 5.9
  Top Layer w0.254: U2.18 H10.3
$1N8894: length 5.9
  Top Layer w0.254: H13.3 U6.8
$1N8902: length 7.1
  Top Layer w0.254: H13.1 U6.6
$1N8906: length 7
  Top Layer w0.254: H12.1 U6.1
$1N8914: length 5.8
  Top Layer w0.254: H12.3 U6.3
$1N8918: length 6.1
  Top Layer w0.254: H12.4 U6.4
$1N8926: length 7
  Top Layer w0.254: U6.11 H15.5
$1N8930: length 6.1
  Top Layer w0.254: H15.4 U6.12
$1N8934: length 5.8
  Top Layer w0.254: U6.13 H15.3
$1N8946: length 7.1
  Top Layer w0.254: U6.20 H14.1
$1N8950: length 6.2
  Top Layer w0.254: H14.2 U6.19
$1N8954: length 5.9
  Top Layer w0.254: U6.18 H14.3
$1N9441: length 8.5
  Top Layer w0.254: U3.18 H2.3 LED1.1
$1N9987: length 6.1
  Top Layer w0.254: U7.7 H18.2 ; R13.2 24.91,23 arc(25.01,22.91) 25.15,22.86
$1N10119: length 9.9
  Top Layer w0.254: H17.3 U7.3 ; R14.1 18.18,23.11 arc(17.75,21.65) 16.4,20.96
$1N10752: length 8.7
  Top Layer w0.254: U2.7 H9.2 61.6,7.58 arc(61.56,7.4) R20.1
$1N10761: length 9.6
  Top Layer w0.254: U2.5 H8.5 arc(56.36,12.31) 56.39,12.14 R19.1
$1N11051: length 8.8
  Top Layer w0.254: U6.7 H13.2 arc(80.38,9.63) 80.38,9.61 R22.1
$1N11053: length 11
  Top Layer w0.254: U6.5 H12.5 73.73,11.12 arc(73.13,10.21) R21.1
$1N12565: length 39.4
  Top Layer w0.254: U3.13 H4.3 ; R11.1 54.5,28.08 arc(54.43,27.73) v1(54.23,27.43) ; U8.1 v1(38.86,10.8)
  Bottom Layer w0.254: v1(38.86,10.8) 40.2,12.14 arc(46.17,16.12) H4.3 52.89,17.85 arc(51.62,19.74) 51.18,21.97 arc(51.37,22.91) 51.9,23.71 53.24,25.05 arc(53.97,26.14) v1(54.23,27.43)
$1N12614: length 10.7
  Top Layer w0.254: U3.9 H3.4 47.88,7.48 ; 47.88,7.48 49.64,7.48 arc(49.8,7.41) U9.2 ; 47.88,7.48 arc(47.84,7.39) R10.2
$1N12663: length 9.6
  Top Layer w0.254: U3.10 H3.5 52.96,9.65 arc(52.97,9.64) U10.1
$1N12744: length 12.6
  Top Layer w0.254: R8.2 37.08,22.73 37.21,22.86 arc(37.39,22.79) H1.1 ; H1.1 37.47,25.34 arc(37.42,25.45) U11.2 ; H1.1 U3.1
$1N14394: length 11.8
  Top Layer w0.254: U3.20 H2.1 40.26,27.38 ; U12.1 40.53,27.3 arc(40.39,27.32) 40.26,27.38 ; 40.26,27.38 40.26,27.58 arc(40.18,27.75) R7.2
$1N14584: length 13.9
  Top Layer w0.254: U2.2 H8.2 arc(54.71,22.39) 54.16,25.14 U13.2 56.1,25.26 arc(56.14,25.27) R28.1
$1N14688: length 14.5
  Top Layer w0.254: 75.17,25.4 75.17,26.91 75.3,27.04 arc(75.27,27.18) 75.18,27.31 ; R29.1 73.79,24.27 73.79,21.34 H12.2 U6.2
$1N16398: length 1.7
  Top Layer w0.254: D4.2 65.35,4.19 arc(65.33,4.26) R31.1
$1N16437: length 1.6
  Top Layer w0.254: D5.2 50.04,2.1 arc(50.37,2.04) R32.1
$2N2411: length 3.1
  Top Layer w0.254: LED3.1 78.87,50.63 arc(78.12,50.48) R23.1
$2N2617: length 5.5
  Top Layer w0.254: R24.1 62.08,50.07 arc(61.82,50.02) U4.2
$2N2776: length 9.3
  Top Layer w0.254: U5.1 51.84,47.42 arc(51.9,47.41) R25.1
$3N690: length 4.5
  Top Layer w0.254: R30.1 4.32,24.79 arc(3.63,24.65) U15.1 3.05,22.52 arc(3.09,22.3) 3.22,22.12
$3N846: length 1.9
  Top Layer w0.254: R30.2 5.21,28.37 arc(5.24,28.53) 5.34,28.68
$4N474: length 4.7
  Top Layer w0.254: U19.1 2.23,45.64 ; 2.23,45.64 2.23,43.25 H24.1 ; 2.23,45.64 R34.1
$4N840: length 4.6
  Top Layer w0.254: U20.1 7.31,45.64 R36.1 7.26,43.2 H24.3
$4N848: length 4.6
  Top Layer w0.254: U21.1 12.39,45.64 R38.1 12.34,43.2 H24.5
$4N867: length 4.6
  Top Layer w0.254: H24.2 4.17,43.2 R34.2 4.12,45.64 U19.2
$4N881: length 4.6
  Top Layer w0.254: H24.6 14.34,43.2 R38.2 14.29,45.64 U21.2
$4N888: length 4.7
  Top Layer w0.254: 9.2,45.64 9.2,43.25 H24.4 ; 9.2,45.64 U20.2 ; 9.2,45.64 R36.2
$4N1041: length 2.5
  Top Layer w0.254: H16.1 2.17,53.83 R33.2
$4N1043: length 2.5
  Top Layer w0.254: R35.2 7.26,53.83 H16.3
$4N1045: length 2.5
  Top Layer w0.254: H16.5 12.21,53.96 R37.2
$4N1047: length 2.6
  Top Layer w0.254: R39.2 17.54,53.71 H16.7
$4N1080: length 4.6
  Top Layer w0.254: H16.2 4.17,53.83 R33.1 U19.3
$4N1095: length 4.6
  Top Layer w0.254: U20.3 R35.1 9.26,53.83 H16.4
$4N1106: length 4.6
  Top Layer w0.254: U21.3 R37.1 14.21,53.71 H16.6
$4N1121: length 4.6
  Top Layer w0.254: U22.3 R39.1 19.69,51.83 H16.8
$4N1148: length 4.6
  Top Layer w0.254: U22.1 17.42,47.36 R40.1 17.42,43.2 H24.7
$4N1160: length 4.6
  Top Layer w0.254: U22.2 19.42,47.36 R40.2 19.42,43.2 H24.8
$5N412: length 2.7
  Top Layer w0.254: LED4.1 29.13,56.31 29.01,56.19 J5.1
$5N415: length 2.5
  Top Layer w0.254: J6.1 31.61,56.13 30.23,56.13 LED4.2
$5N454: length 2
  Top Layer w0.254: J7.1 33.84,57.79 D6.A
$5N456: length 2.4
  Top Layer w0.254: J8.1 34.97,55.82 D6.K
$5N2282: length 7
  Top Layer w0.254: R42.2 34.15,47.3 U23.1 34.14,48.53 R41.1 35.46,49.85 C9.1
$5N2306: length 6.9
  Top Layer w0.254: U23.3 30.9,47.3 C10.1 28.11,48.06 R43.2 27.98,49.79 D7.K
$5N2329: length 7.7
  Top Layer w0.254: H25.3 32.24,43.82 U23.4 31.22,46.06 C10.2 28.11,46.06 R43.1
$5N2356: length 5.9
  Top Layer w0.254: U23.5 34.14,44.58 H25.1 R42.1
$5N2498: length 8.5
  Top Layer w0.508: H25.4 25.48,45.63 LED5.1
$5N2505: length 7.9
  Top Layer w0.254: 24.38,47.82 LED5.2
  Top Layer w0.508: 24.38,47.82 24.38,44.18 H25.5

## Copper pours and planes (outline as drawn; the poured copper is in the pictures)
AGND on Top Layer: 23.3,40.96 23.3,53.02 38.16,53.02 38.16,40.96
GND on Top Layer: 0,39.12 92.84,39.12 92.84,0 0,0
GND on Bottom Layer: -0.13,39.12 92.71,39.12 92.71,0 -0.13,0
$2N4159 on Top Layer: 40.51,56.64 92.96,56.64 92.96,41.53 40.51,41.53

## Text on the board
Bottom Layer: BC
Bottom Silkscreen Layer: BS | HV_Vcc | LV_Vcc | HV_Vin | LV_Vin | - | + | +3.3V | IR | UV | GND | INT | RESN | -|+|SDA|SCL | VIS | -|MOSI|+ | EE|SCK|MISO | -|WP|MISO|EE | MOSI|SCK|HOLD|+ | + - | +-OAK | Master Thesis / Tim Jäger
Top Layer: TC
Top Silkscreen Layer: TS | A | K | +- | + -
